# EAGLE design Seeeduino Stalker v3.1 (EAGLE 6.4)
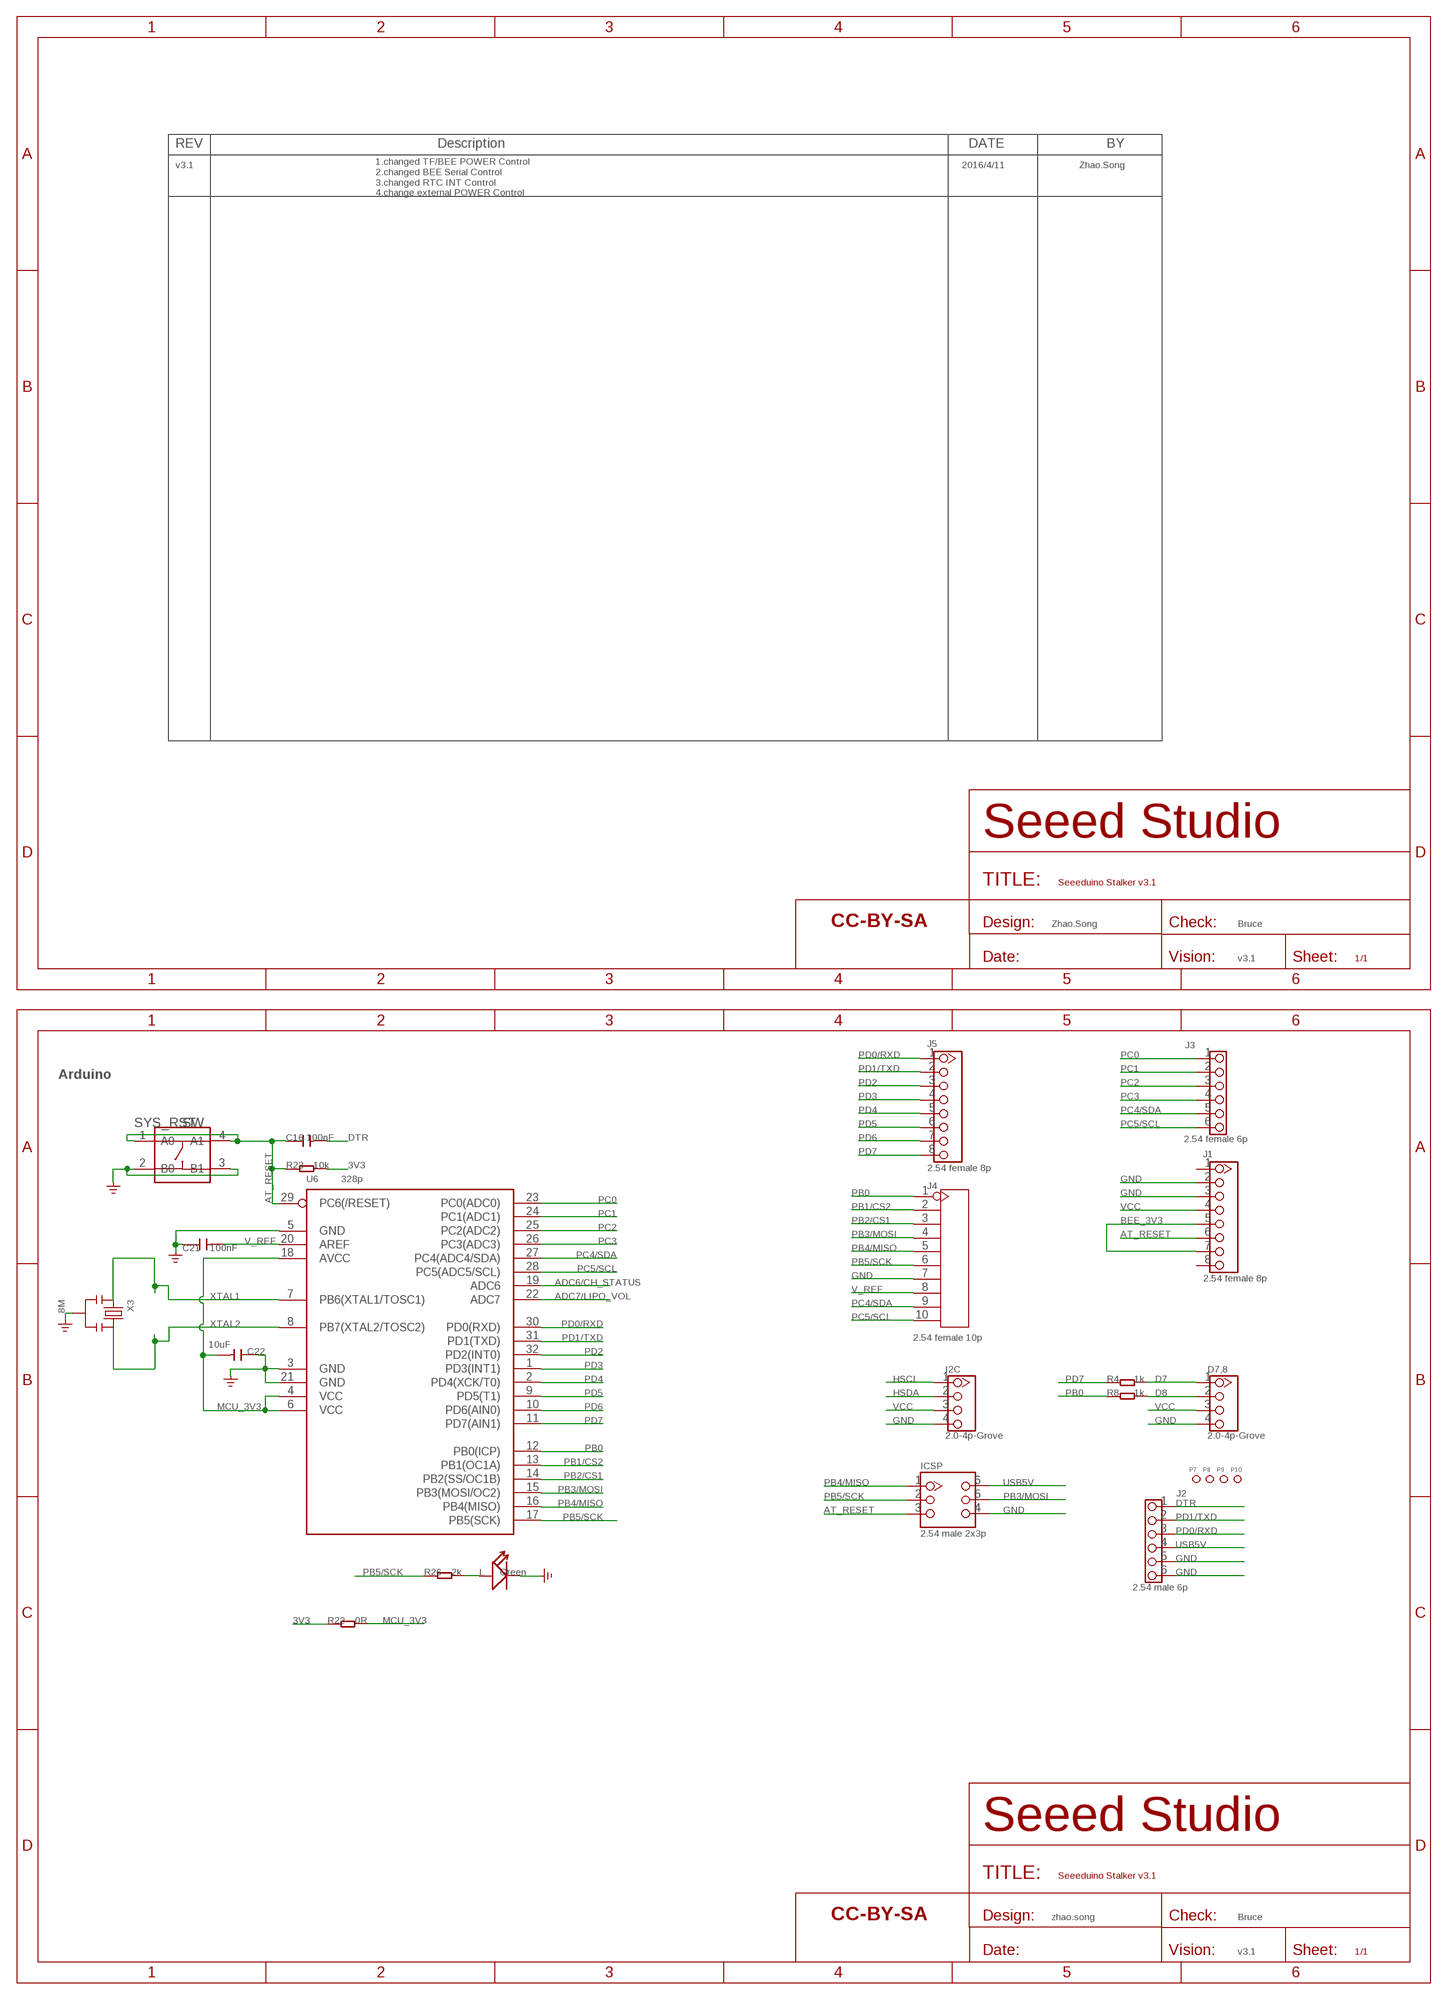
[diagram p0: schematic, sheet 1, part 1 of 2]
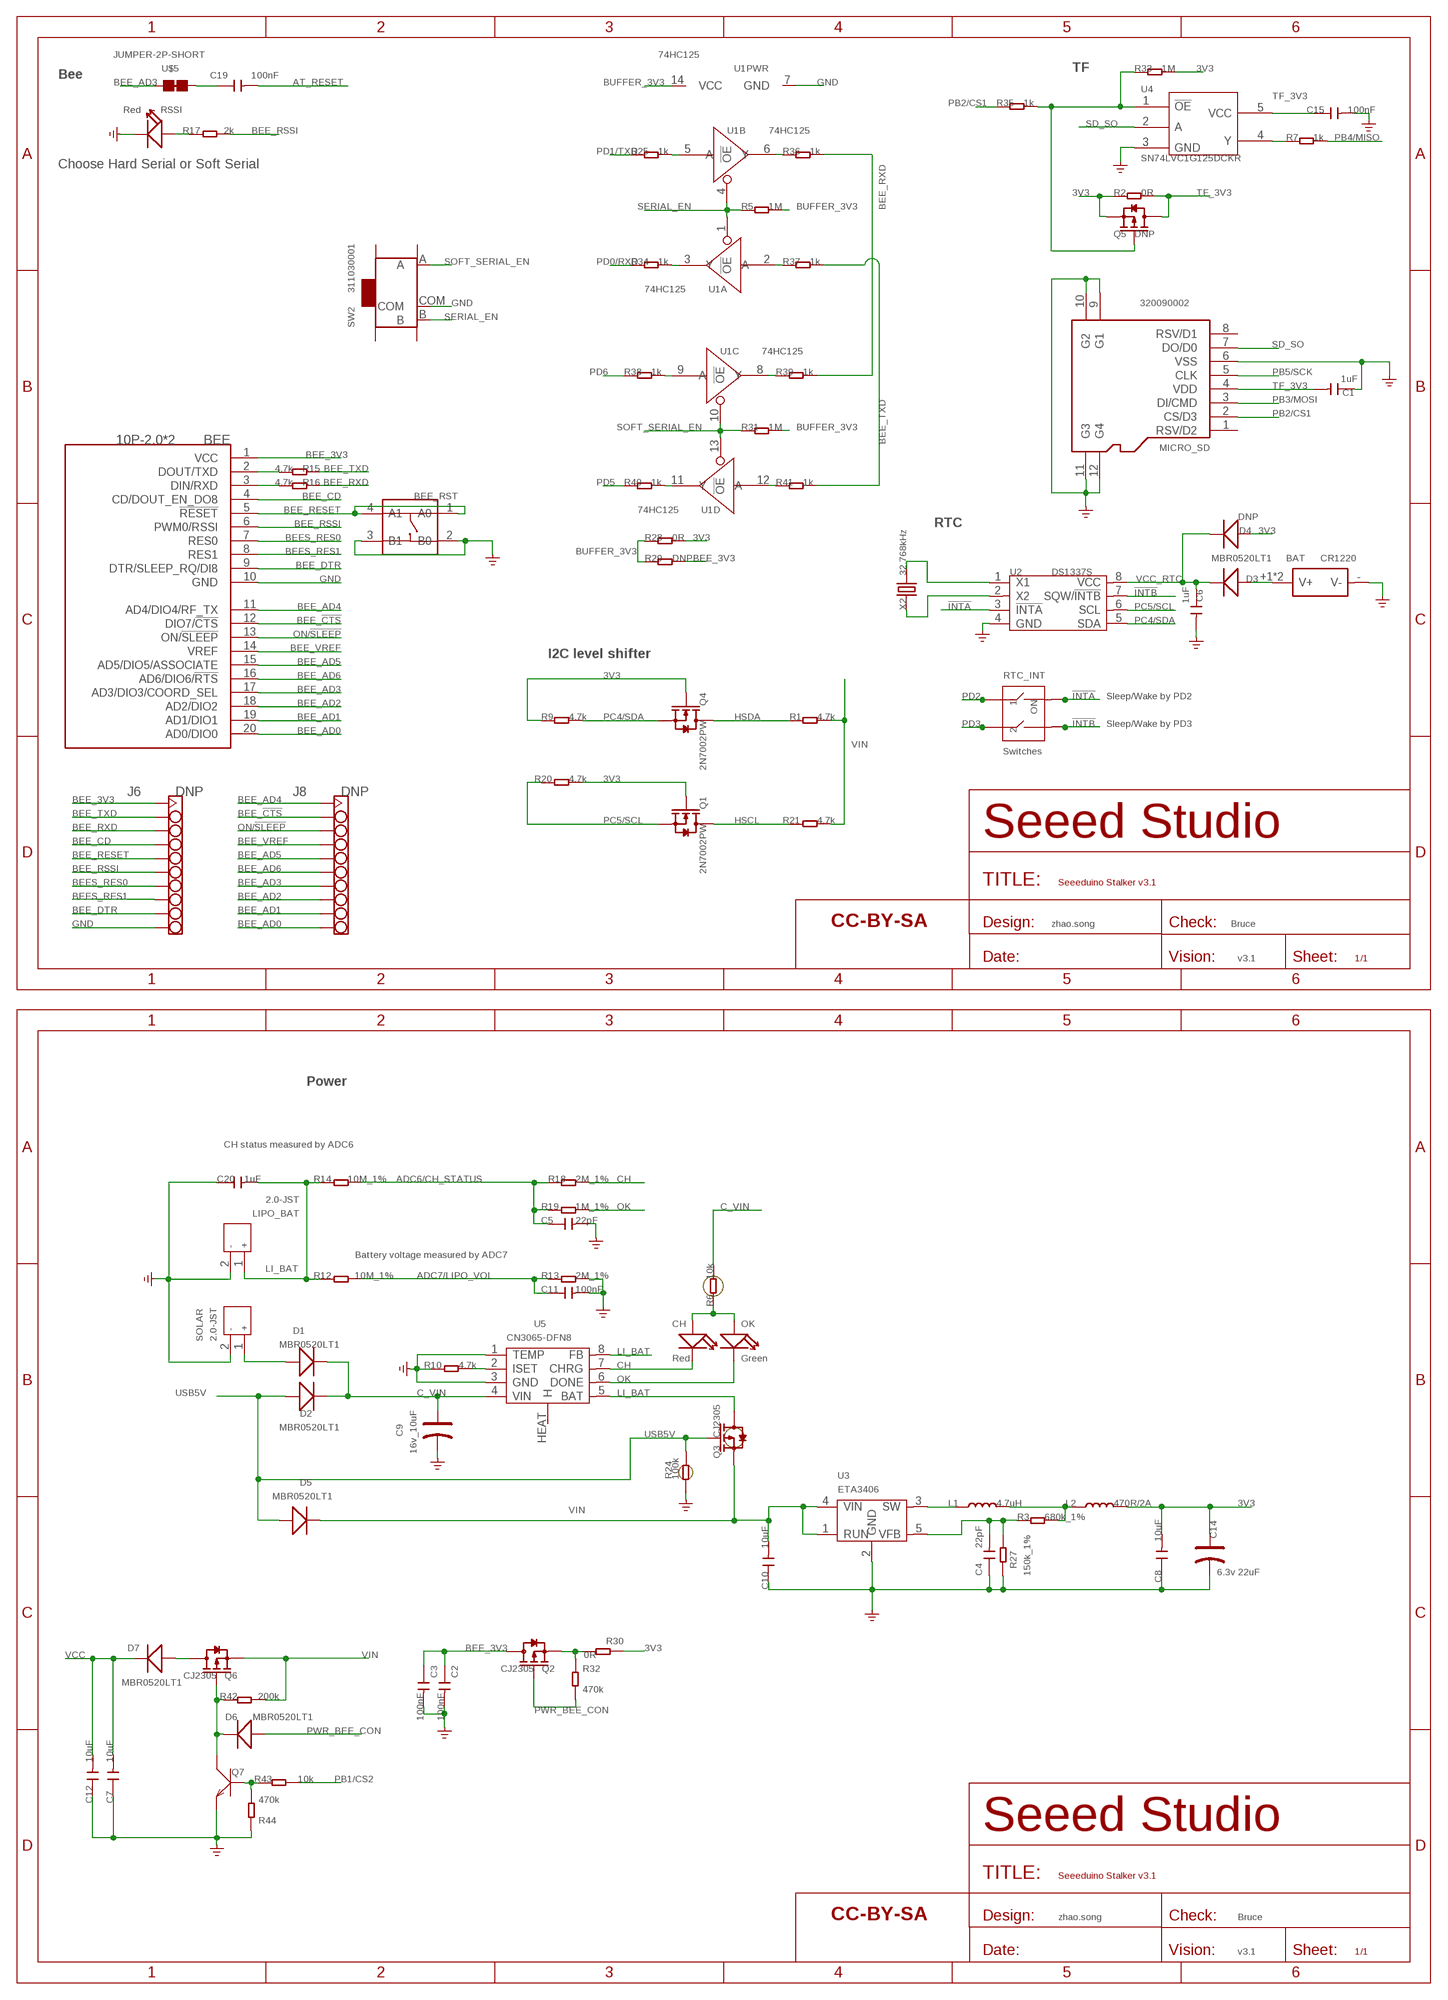
[diagram p1: schematic, sheet 1, part 2 of 2]

## Parts
BAT  CR1220  BAT-HOLDER-1220  [BAT2P-13.5-CR1220]
BEE  10P-2.0*2  BEEO  [BEE]
BEE_RST  SW  BUTTON-4P-6X6-SMD  [4P-SMD-6.2X6.2X4H]
C1  1uF  C-0805  [C0805]
C2  100nF  C-0603  [C0603]
C3  100nF  C-0603  [C0603]
C4  22pF  C-0603  [C0603]
C5  22pF  C-0603  [C0603]
C6  1uF  C-0805  [C0805]
C7  10uF  C-0805  [C0805]
C8  10uF  C-0805  [C0805]
C9  16v_10uF  CAP-AVX-A  [AVX-A]
C10  10uF  C-0805  [C0805]
C11  100nF  C-0603  [C0603]
C12  10uF  C-0805  [C0805]
C14  6.3v 22uF  CAP-AVX-A  [AVX-A]
C15  100nF  C-0603  [C0603]
C16  100nF  C-0603  [C0603]
C19  100nF  C-0603  [C0603]
C20  1uF  C-0805  [C0805]
C21  100nF  C-0603  [C0603]
C22  10uF  C-0805  [C0805]
CH  Red  007-LED0603  [D0603]
D1  MBR0520LT1  D'MBR0520LT1'  [SOD123-2.7X1.6]
D2  MBR0520LT1  D'MBR0520LT1'  [SOD123-2.7X1.6]
D3  MBR0520LT1  D'MBR0520LT1'  [SOD123-2.7X1.6]
D4  DNP  D'MBR0520LT1'  [SOD123-2.7X1.6]
D5  MBR0520LT1  D'MBR0520LT1'  [SOD123-2.7X1.6]
D6  MBR0520LT1  D'MBR0520LT1'  [SOD123-2.7X1.6]
D7  MBR0520LT1  D'MBR0520LT1'  [SOD123-2.7X1.6]
D7,8  2.0-4p-Grove  TWIG-4P-2.0-2.0  [4P-2.0]
I2C  2.0-4p-Grove  TWIG-4P-2.0-2.0  [4P-2.0]
ICSP  2.54 male 2x3p  HEADER-2X3P-2.54  [2X3P-2.54-LEADED]
J1  2.54 female 8p  HEADER-8P-2.54-LEADED  [8P-2.54-LEADED]
J2  2.54 male 6p  HEADER-6P-LEADED-2.54  [6P-2.54-LEADED]
J3  2.54 female 6p  HEADER-6P-LEADED-2.54  [6P-2.54-LEADED]
J4  2.54 female 10p  HEADER-10P-2.54  [10P-2.54]
J5  2.54 female 8p  HEADER-8P-2.54-LEADED  [8P-2.54-LEADED]
J6  DNP  HEADER_1X10DD  [HEADER_1X10]
J8  DNP  HEADER_1X10DD  [HEADER_1X10]
L  Green  007-LED0603  [D0603]
L1  4.7uH  LSPD3D16-4R7M  [L0420]
L2  470R/2A  L'0805'  [L0805]
LIPO_BAT  2.0-JST  JACK-JST-2P-PW'2.0'  [JST-2.0]
MICRO_SD  320090002  MICRO-SD-CARD-HOLDER-8P  [MICRO-SD8+4P-SMD-14.5X13.6X1.8MM]
OK  Green  007-LED0603  [D0603]
P7  DNP  PAD-MARK  [ROUND-MARK-1.0]
P8  DNP  PAD-MARK  [ROUND-MARK-1.0]
P9  DNP  PAD-MARK  [ROUND-MARK-1.0]
P10  DNP  PAD-MARK  [ROUND-MARK-1.0]
Q1  2N7002PW  MOSFET-N'SOT23'  [SOT23]
Q2  CJ2305  MOSFET-P'SI2323CDS/SI2305DS<BR>'  [SOT23]
Q3  CJ2305  MOSFET-P'SI2323CDS/SI2305DS<BR>'  [SOT23]
Q4  2N7002PW  MOSFET-N'SOT23'  [SOT23]
Q5  DNP  MOSFET-P'SI2323CDS/SI2305DS<BR>'  [SOT23]
Q6  CJ2305  MOSFET-P'SI2323CDS/SI2305DS<BR>'  [SOT23]
Q7  TRANSISTOR-NPN-SOT23  [SOT-23]
R1  4.7k  005-R0603  [0603@1]
R2  0R  005-R0603  [0603@1]
R3  680k_1%  005-R0603  [0603@1]
R4  1k  005-R0603  [0603@1]
R5  1M  005-R0603  [0603@1]
R6  10k  005-R0603  [0603@1]
R7  1k  005-R0603  [0603@1]
R8  1k  005-R0603  [0603@1]
R9  4.7k  005-R0603  [0603@1]
R10  4.7k  005-R0603  [0603@1]
R12  10M_1%  005-R0603  [0603@1]
R13  2M_1%  005-R0603  [0603@1]
R14  10M_1%  005-R0603  [0603@1]
R15  4.7k  005-R0603  [0603@1]
R16  4.7k  005-R0603  [0603@1]
R17  2k  005-R0603  [0603@1]
R18  2M_1%  005-R0603  [0603@1]
R19  1M_1%  005-R0603  [0603@1]
R20  4.7k  005-R0603  [0603@1]
R21  4.7k  005-R0603  [0603@1]
R22  0R  005-R0603  [0603@1]
R23  10k  005-R0603  [0603@1]
R24  100k  005-R0603  [0603@1]
R25  1k  005-R0603  [0603@1]
R26  2k  005-R0603  [0603@1]
R27  150k_1%  005-R0603  [0603@1]
R28  0R  005-R0603  [0603@1]
R29  DNP  005-R0603  [0603@1]
R30  0R  005-R0603  [0603@1]
R31  1M  005-R0603  [0603@1]
R32  470k  005-R0603  [0603@1]
R33  1M  005-R0603  [0603@1]
R34  1k  005-R0603  [0603@1]
R35  1k  005-R0603  [0603@1]
R36  1k  005-R0603  [0603@1]
R37  1k  005-R0603  [0603@1]
R38  1k  005-R0603  [0603@1]
R39  1k  005-R0603  [0603@1]
R40  1k  005-R0603  [0603@1]
R41  1k  005-R0603  [0603@1]
R42  200k  005-R0603  [0603@1]
R43  10k  005-R0603  [0603@1]
R44  470k  005-R0603  [0603@1]
RSSI  Red  007-LED0603  [D0603]
RTC_INT  Switches  SWITCHES-2X2P'KM-02'  [SW4-SMD-2.54-5.08X6.8X3.3MM]
SOLAR  2.0-JST  JACK-JST-2P-PW'2.0'  [JST-2.0]
SW2  311030001  SWITCH-3+4P  [SW7-SMD-L6.7X2.7X3.2MM]
SYS_RST  SW  BUTTON-4P-6X6-SMD  [4P-SMD-6.2X6.2X4H]
U1  74HC125  LOGIC-74HCT125PW  [TSSOP14-0.65-5X4.4MM]
U2  DS1337S  [SOP8]
U3  ETA3406  TD6810'TSOT23-5'  [SOT23-5]
U4  SN74LVC1G125DCKR  [SOT353]
U5  CN3065-DFN8  [DFN8]
U6  328p  MCU-ATMEGA8/168/328'AU'  [TQFP32-0.8-7X7MM]
U$2  DNP  SEEEDSTUDIO-OPEN-SCH-FRAME  [SEEEDSTUDIO-PCB-FRAME]
U$5  JUMPER-2P-SHORT  [2P-SMD-SHORT]
U$11  DNP  SEEEDSTUDIO-OPEN-SCH-FRAME  [SEEEDSTUDIO-PCB-FRAME]
U$12  DNP  SEEEDSTUDIO-OPEN-SCH-FRAME  [SEEEDSTUDIO-PCB-FRAME]
U$27  DNP  SEEEDSTUDIO-OPEN-SCH-FRAME  [SEEEDSTUDIO-PCB-FRAME]
X2  32.768kHz  CRYSTAL-3215  [2P-SMD-3.2X1.5]
X3  8M  CRYSTAL-RESONATOR'SMD'  [RESONATOR3-SMD-3.6X1.3X0.8MM]

## Nets
3V3: C8.2 C14.+ D4.1(+) L2.2 Q1.1(G) Q4.1(G) Q5.2(S) R2.1 R9.1 R20.2 R22.1 R23.2 R28.2 R30.1 R33.2
!INTA: RTC_INT.4 U2.3(!INTA)
!INTB: RTC_INT.3 U2.7(SQW/!INTB)
ADC6/CH_STATUS: C5.1 R14.2 R18.1 R19.1 U6.19(ADC6)
ADC7/LIPO_VOL: C11.1 R12.2 R13.1 U6.22(ADC7)
AT_RESET: C16.1 C19.2 ICSP.3 J1.6 R23.1 SYS_RST.1(A0) SYS_RST.4(A1) U6.29(PC6(/RESET))
BEE_3V3: BEE.1(VCC) C2.1 C3.1 J1.5 J1.7 J6.1 Q2.3(D) R29.2
BEE_!CTS: BEE.12(DIO7/!CTS) J8.2
BEE_AD0: BEE.20(AD0/DIO0) J8.10
BEE_AD1: BEE.19(AD1/DIO1) J8.9
BEE_AD2: BEE.18(AD2/DIO2) J8.8
BEE_AD3: BEE.17(AD3/DIO3/COORD_SEL) J8.7 U$5.1
BEE_AD4: BEE.11(AD4/DIO4/RF_TX) J8.1
BEE_AD5: BEE.15(AD5/DIO5/ASSOCIATE) J8.5
BEE_AD6: BEE.16(AD6/DIO6/!RTS) J8.6
BEE_CD: BEE.4(CD/DOUT_EN_DO8) J6.4
BEE_DTR: BEE.9(DTR/SLEEP_RQ/DI8) J6.9
BEE_RESET: BEE.5(!RESET) BEE_RST.1(A0) BEE_RST.4(A1) J6.5
BEE_RSSI: BEE.6(PWM0/RSSI) J6.6 R17.2
BEE_RXD: J6.3 R16.1 R36.2 R39.2
BEE_TXD: J6.2 R15.1 R37.2 R41.2
BEE_VREF: BEE.14(VREF) J8.4
BEES_RES0: BEE.7(RES0) J6.7
BEES_RES1: BEE.8(RES1) J6.8
BUFFER_3V3: R5.2 R28.1 R29.1 R31.2 U1.14(PWR:VCC)
C_VIN: C9.+ D1.2(-) D2.2(-) R6.2 U5.4(VIN)
CH: CH.- R18.2 U5.7(CHRG)
D7: D7,8.1 R4.2
D8: D7,8.2 R8.2
DTR: C16.2 J2.1
GND: BAT.-(V-) BEE.10(GND) BEE_RST.2(B0) BEE_RST.3(B1) C1.1 C2.2 C3.2 C4.1 C5.2 C6.2 C7.1 C8.1 C9.- C10.1 C11.2 C12.1 C14.- C15.2 C20.1 C21.1 C22.1 D7,8.4 I2C.4 ICSP.4 J1.2 J1.3 J2.5 J2.6 J4.7 J6.10 L.- LIPO_BAT.2 MICRO_SD.6(VSS) MICRO_SD.9(G1) MICRO_SD.10(G2) MICRO_SD.11(G3) MICRO_SD.12(G4) Q7.2(E) R10.1 R13.2 R24.1 R27.1 R44.2 RSSI.- SOLAR.2 SW2.COM SYS_RST.2(B0) SYS_RST.3(B1) U1.7(PWR:GND) U2.4(GND) U3.2(GND) U4.3(GND) U5.1(TEMP) U5.3(GND) U6.3(GND) U6.5(GND) U6.21(GND) X3.2 ; supply symbol labelled GND_POWER
HSCL: I2C.1 Q1.3(D) R21.1
HSDA: I2C.2 Q4.3(D) R1.1
LI_BAT: C20.2 LIPO_BAT.1 Q3.3(D) R12.1 R14.1 U5.5(BAT) U5.8(FB)
MCU_3V3: C22.2 R22.2 U6.4(VCC) U6.6(VCC) U6.18(AVCC)
N$1: C4.2 R3.1 R27.2 U3.5(VFB)
N$2: C19.1 U$5.2
N$3: D1.1(+) SOLAR.1
N$4: BAT.+1(V+) BAT.+2(V+) D3.1(+)
N$5: R10.2 U5.2(ISET)
N$6: R17.1 RSSI.+
N$7: U2.1(X1) X2.2
N$8: CH.+ OK.+ R6.1
N$9: U2.2(X2) X2.1
N$13: R34.2 U1.3(A:Y)
N$14: D7.1(+) Q6.3(D)
N$15: R38.2 U1.9(C:A)
N$16: Q7.1(B) R43.2 R44.1
N$17: L1.2 L2.1 R3.2
N$18: L1.1 U3.3(SW)
N$19: R7.1 U4.4(Y)
N$20: R40.2 U1.11(D:Y)
N$22: L.+ R26.2
N$23: R36.1 U1.6(B:Y)
N$24: BEE.2(DOUT/TXD) R15.2
N$25: BEE.3(DIN/RXD) R16.2
N$27: R37.1 U1.2(A:A)
N$28: R39.1 U1.8(C:Y)
N$29: R41.1 U1.12(D:A)
N$30: R25.2 U1.5(B:A)
N$31: Q2.2(S) R30.2 R32.1
N$32: Q5.1(G) R33.1 R35.2 U4.1(!OE!)
N$35: D6.2(-) Q6.1(G) Q7.3(C) R42.2
OK: OK.- R19.2 U5.6(DONE)
ON/!SLEEP: BEE.13(ON/!SLEEP) J8.3
PB0: J4.1 R8.1 U6.12(PB0(ICP))
PB1/CS2: J4.2 R43.1 U6.13(PB1(OC1A))
PB2/CS1: J4.3 MICRO_SD.2(CS/D3) R35.1 U6.14(PB2(SS/OC1B))
PB3/MOSI: ICSP.5 J4.4 MICRO_SD.3(DI/CMD) U6.15(PB3(MOSI/OC2))
PB4/MISO: ICSP.1 J4.5 R7.2 U6.16(PB4(MISO))
PB5/SCK: ICSP.2 J4.6 MICRO_SD.5(CLK) R26.1 U6.17(PB5(SCK))
PC0: J3.1 U6.23(PC0(ADC0))
PC1: J3.2 U6.24(PC1(ADC1))
PC2: J3.3 U6.25(PC2(ADC2))
PC3: J3.4 U6.26(PC3(ADC3))
PC4/SDA: J3.5 J4.9 Q4.2(S) R9.2 U2.5(SDA) U6.27(PC4(ADC4/SDA))
PC5/SCL: J3.6 J4.10 Q1.2(S) R20.1 U2.6(SCL) U6.28(PC5(ADC5/SCL))
PD0/RXD: J2.3 J5.1 R34.1 U6.30(PD0(RXD))
PD1/TXD: J2.2 J5.2 R25.1 U6.31(PD1(TXD))
PD2: J5.3 RTC_INT.1 U6.32(PD2(INT0))
PD3: J5.4 RTC_INT.2 U6.1(PD3(INT1))
PD4: J5.5 U6.2(PD4(XCK/T0))
PD5: J5.6 R40.1 U6.9(PD5(T1))
PD6: J5.7 R38.1 U6.10(PD6(AIN0))
PD7: J5.8 R4.1 U6.11(PD7(AIN1))
PWR_BEE_CON: D6.1(+) Q2.1(G) R32.2
SD_SO: MICRO_SD.7(DO/D0) U4.2(A)
SERIAL_EN: R5.1 SW2.B U1.1(A:!OE) U1.4(B:!OE)
SOFT_SERIAL_EN: R31.1 SW2.A U1.10(C:!OE) U1.13(D:!OE)
TF_3V3: C1.2 C15.1 MICRO_SD.4(VDD) Q5.3(D) R2.2 U4.5(VCC)
USB5V: D2.1(+) D5.1(+) ICSP.6 J2.4 Q3.1(G) R24.2
V_REF: C21.2 J4.8 U6.20(AREF)
VCC: C7.2 C12.2 D7,8.3 D7.2(-) I2C.3 J1.4
VCC_RTC: C6.1 D3.2(-) D4.2(-) U2.8(VCC)
VIN: C10.2 D5.2(-) Q3.2(S) Q6.2(S) R1.2 R21.2 R42.1 U3.1(RUN) U3.4(VIN)
XTAL1: U6.7(PB6(XTAL1/TOSC1)) X3.1
XTAL2: U6.8(PB7(XTAL2/TOSC2)) X3.3
Unconnected: J1.1 J1.8 MICRO_SD.1(RSV/D2) MICRO_SD.8(RSV/D1) SW2.SS1 SW2.SS2 SW2.SS3 SW2.SS4 U5.HEAT(H)

## Notes on the sheet
- TF
- Bee
- v3.1 | 2016/4/11 | Zhao.Song | Choose Hard Serial or Soft Serial
- 1.changed TF/BEE POWER Control
  2.changed BEE Serial Control
  3.changed RTC INT Control
  4.change external POWER Control
- RTC
- I2C level shifter
- Sleep/Wake by PD2
- Sleep/Wake by PD3
- Zhao.Song | Bruce | zhao.song | Bruce
- v3.1 | v3.1
- Arduino
- Power
- CH status measured by ADC6
- Battery voltage measured by ADC7
- zhao.song | Bruce | zhao.song | Bruce
- v3.1 | v3.1

## Library data of the parts
BAT = Connector-new:BAT-HOLDER: BAT2P-13.5-CR1220:320170002;BAT2P-SMD-20.5-CR1632:320170007;METAL-CR2032-D20.0*H6.3MM:320170003;METAL-CR2032-SMD:320170006;PLASTIC-CR1220-L15.06*W13.0*H4.1MM:320170000;PLASTIC-CR2032-L25.2*W15.6*H5.2MM:320170005;BAT2P-11.55-D12.55-CR1220:313010022
BEE = EXT_moudle:BEE
BEE_RST SYS_RST = Discrete:BUTTON-4P
C1-C8 C10-C12 C15 C16 C19-C22 = Discrete:C*: Ceramic Capacitors
C9 C14 = Discrete:CAP*: Electrolytic Capacitors,Tantalum Capacitors and Super Capacitors
CH L OK RSSI = Discrete:007-LED*
D1-D7 = Discrete:D*
D7,8 I2C = Connector:TWIG-4P-2.0
ICSP = Connector:HEADER-2X3P
J1 J5 = Connector:HEADER-8P
J2 J3 = Connector:HEADER-6P
J4 = Connector :HEADER-10P
J6 J8 = CONNECTER:HEADER_1X10
L1 = template:L
L2 = Discrete:L*
LIPO_BAT SOLAR = Connector:JACK-JST-2P-PW
MICRO_SD = Connector-new:MICRO-SD-CARD-HOLDER-8P: 320090002
P7-P10 = Discrete:PAD-MARK; PARTNO: DNP
Q1 Q4 = Discrete:MOSFET-N: IRLL014: http://www.vishay.com/docs/91319/sihll014.pdf
Q2 Q3 Q5 Q6 = Discrete:MOSFET-P
Q7 = Discrete-new:TRANSISTOR-NPN: NPN audion
R1-R10 R12-R44 = Discrete:005-R*
RTC_INT = Discrete-new:SWITCHES-2X2P
SW2 = Discrete-new:SWITCH-3+4P: SW7-SMD-6.7X2.6X1.4MM-90D:311030002;SW7-SMD-L6.7X2.7X3.2MM:311030001
U1 = IC-new:LOGIC-74*125: Quad Buffer/Line Driver;3-state
U2 = AMLib:DS1337: I2C Serial Real-Time clock http://datasheets.maximintegrated.com/en/ds/DS1337-DS1337C.pdf
U3 = IC:TD6810: 1.5MHz 800mA Synchronous Step-Down Regulator Dropout http://www.techcodeok.com/download/TD6810.pdf
U4 = Test:SN74LVC1G125DCKR: Signal bus buffer gate
U5 = IC:CN3065: USB-Compatible Lithiumt-Ion Battery Charger with Thermal Regulation http://www.consonance-elec.com/pdf/%E6%8A%80%E6%9C%AF%E8%AF%B4%E6%98%8E%E4%B9%A6/DSC-CN3065.pdf
U6 = IC-new:MCU-ATMEGA8/168/328
U$2 U$11 U$12 U$27 = moudle-new:SEEEDSTUDIO-OPEN-SCH-FRAME
U$5 = Discrete-new:JUMPER-2P-SHORT
X2 = Discrete:CRYSTAL*: CRYSTAL
X3 = Discrete-new:CRYSTAL-RESONATOR: Resonator Small SMD resonator. This is the itty bitty 10/20MHz resonators with built in caps. CSTCE10M0G55 and CSTCE20M0V53. Footprint has been reviewed closely but hasn't been tested yet.

## Net classes
0 default: width 0.203 mm, drill 0.305 mm, clearance 0.152 mm

## Board
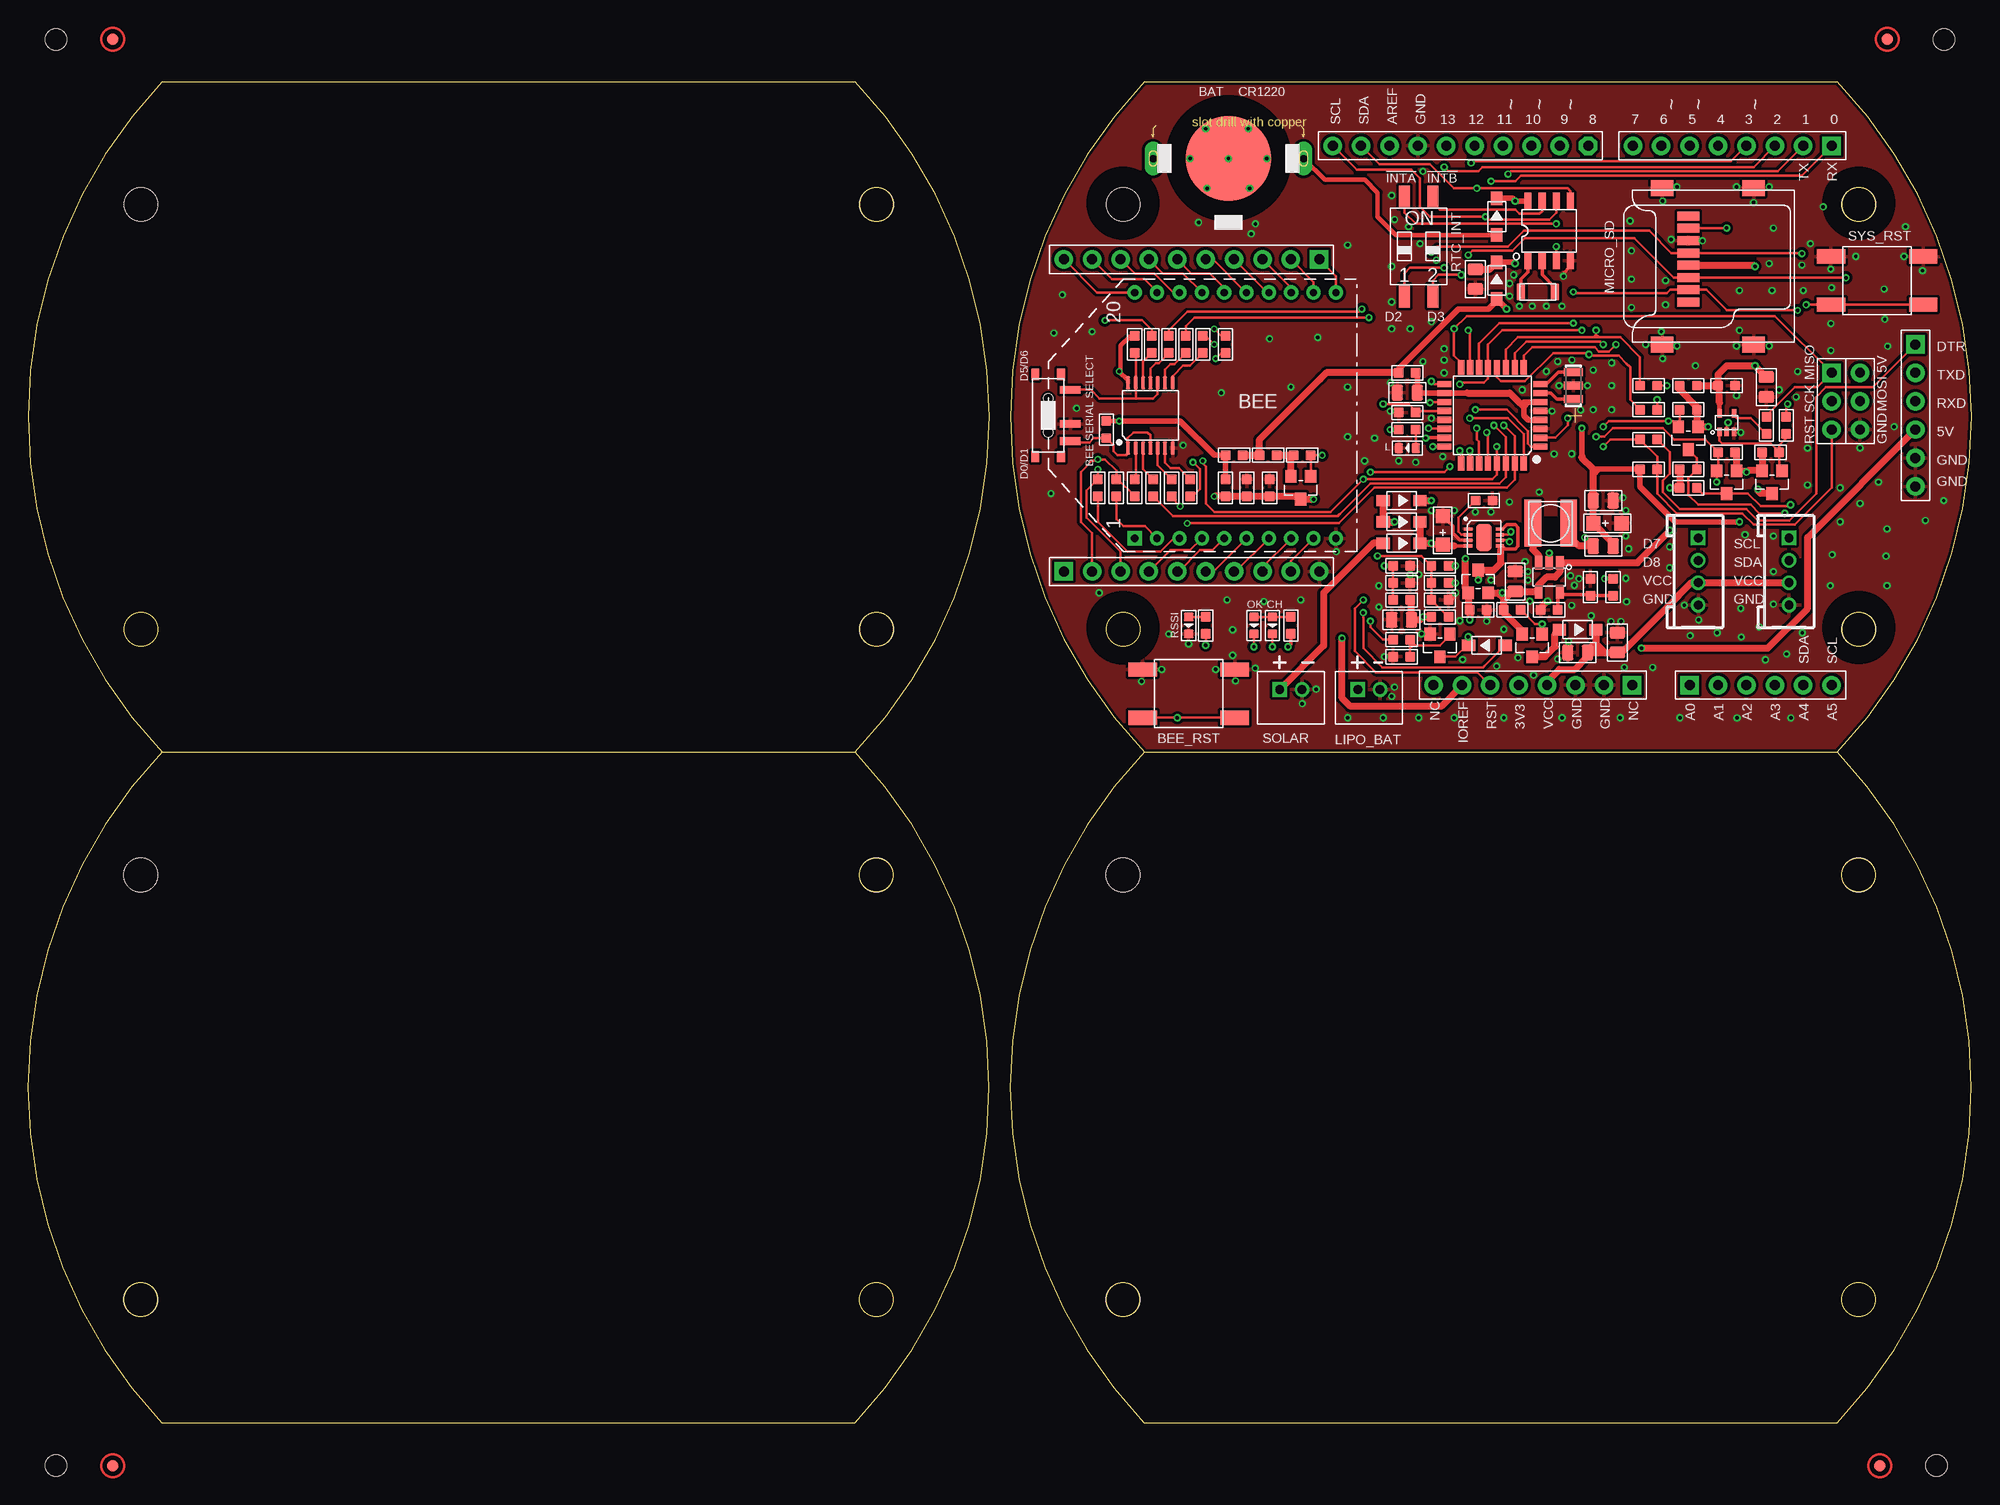
[diagram p2: board, top side]
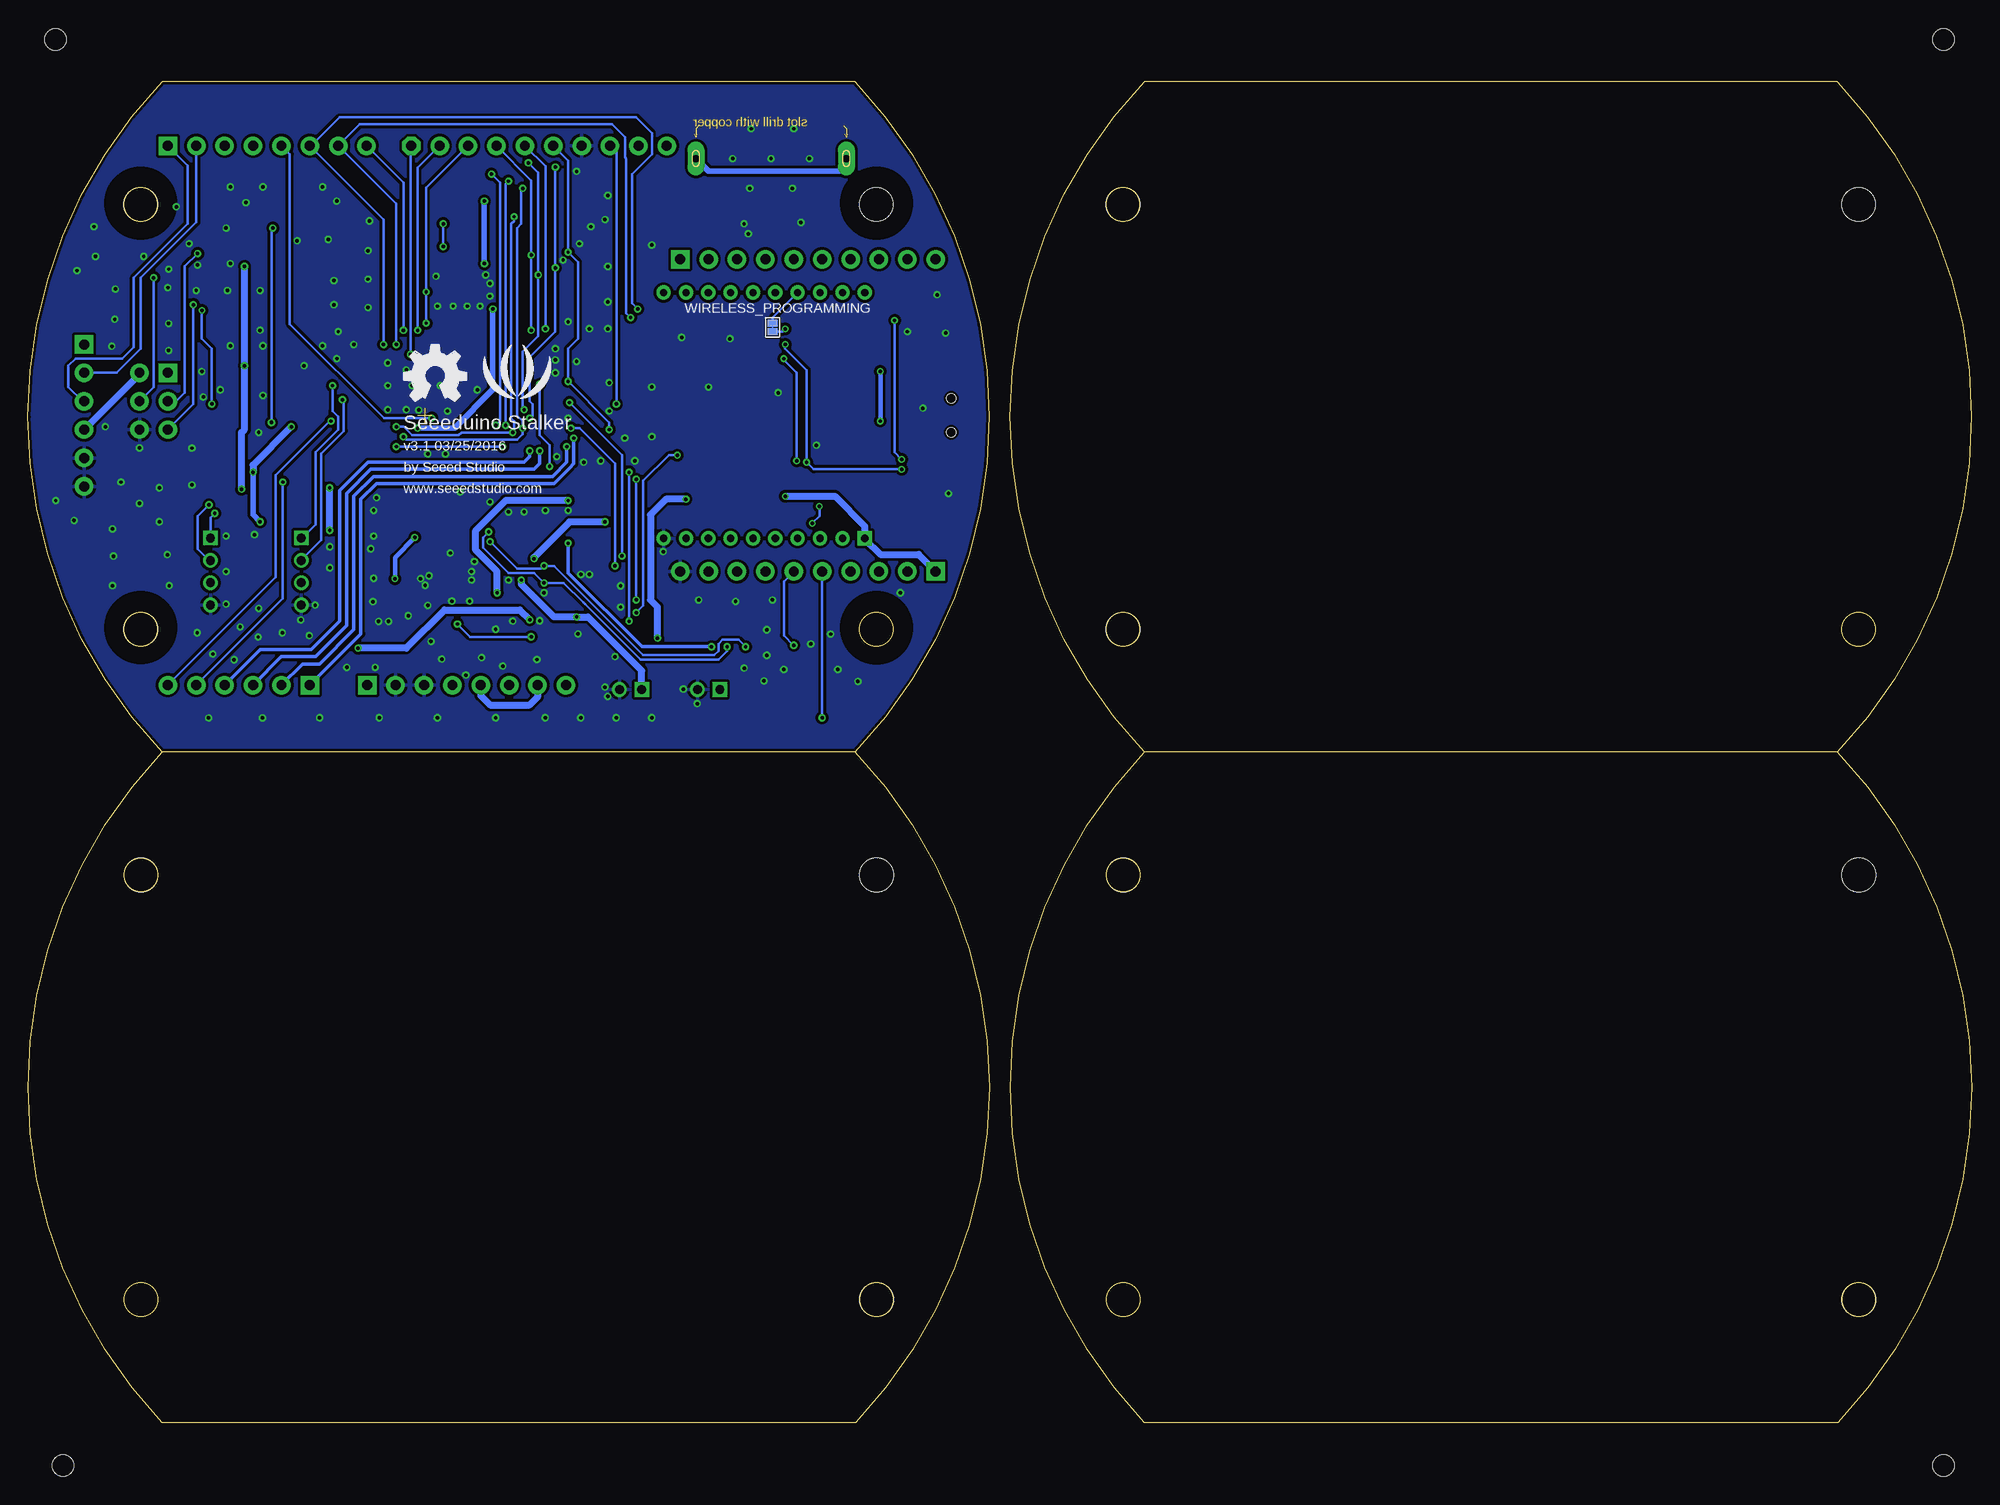
[diagram p3: board, bottom side, seen from below]

Size 173.9 x 120 mm. Coordinates in mm from the lower left corner, seen from the top.
Outline: 99.92,120 161.9,120 arc-87 161.9,60 99.89,60
Outline: 99.92,120 arc87 99.89,60
Outline: 99.9,60 161.88,60 arc-87 161.88,0 99.87,0
Outline: 99.9,60 arc87 99.87,0
Outline: 12.03,120 74.02,120 arc-87 74.02,60 12.01,60
Outline: 12.03,120 arc87 12,60
Outline: 12.01,60 74,60 arc-87 74,0 11.99,0
Outline: 12.01,60 arc87 11.99,0
Outline: circle at 163.81,109 radius 1.5
Outline: circle at 163.81,71 radius 1.5
Outline: circle at 97.99,71 radius 1.5
Outline: circle at 163.8,49 radius 1.5
Outline: circle at 163.8,11 radius 1.5
Outline: circle at 97.97,11 radius 1.5
Outline: circle at 75.93,109 radius 1.5
Outline: circle at 75.93,71 radius 1.5
Outline: circle at 10.11,71 radius 1.5
Outline: circle at 75.91,49 radius 1.5
Outline: circle at 75.91,11 radius 1.5
Outline: circle at 10.09,11 radius 1.5
Copper layers (1*16): Top 0.035mm / dielectric 1.5mm / Bottom 0.035mm
Design rules "default *": minimum track width 1mil, minimum drill 12mil, track to track 6mil, track to pad 6mil, pad to pad 6mil, via to via 6mil, smd to smd 0mil, copper to edge 10mil, drill to drill 10mil, minimum pad ring 10mil, minimum via ring 6mil, stop-mask expansion 2mil, vias tented up to drill 25mil, thermal gap 10mil
Holes 3 mm at 97.99,109 163.82,109 163.82,71 97.99,71 97.97,49 163.8,49 163.8,11 97.97,11 10.11,109 75.93,109 75.93,71 10.11,71 10.09,49 75.91,49 75.91,11 10.09,11
Holes 1.91 mm at 2.51,123.78 171.42,123.78 170.78,-3.85 2.51,-3.85
tRestrict: area 95,106.1 to 101,112.1; area 95,68.1 to 101,74.1; area 160.8,68.1 to 166.8,74.1; area 160.8,106.1 to 166.8,112.1; area 135.4,77 to 137.1,80.9
bRestrict: area 95,106.1 to 101,112.1; area 95,68.1 to 101,74.1; area 160.8,68.1 to 166.8,74.1; area 160.8,106.1 to 166.8,112.1
Milling: 2 lines

### Footprints (pad centres in the part's own frame; a part is rotated, then mirrored left to right if it is on the bottom)
BAT2P-13.5-CR1220 = drill 0.635 pad 1.524 long: +1 6.731,0; +2 -6.731,0 | smd 7.62 x 7.62: - 0,0
BEE = drill 0.635 pad 1.27 square: 1 -11,0 | drill 0.635 pad 1.27: 2 -11,-2; 3 -11,-4; 4 -11,-6; 5 -11,-8; 6 -11,-10; 7 -11,-12; 8 -11,-14; 9 -11,-16; 10 -11,-18; 11 11,-18; 12 11,-16; 13 11,-14; 14 11,-12; 15 11,-10; 16 11,-8; 17 11,-6; 18 11,-4; 19 11,-2; 20 11,0
4P-SMD-6.2X6.2X4H = smd 2.54 x 1.27: 1 -4.129,2.159; 2 -4.129,-2.159; 3 4.129,-2.159; 4 4.129,2.159
C0805 = smd 1.016 x 1.397: 1 -0.889,0; 2 0.889,0
C0603 = smd 0.889 x 0.889: 1 -0.762,0; 2 0.762,0
AVX-A = smd 1.27 x 1.27: + -1.27,0; - 1.27,0
D0603 = smd 0.762 x 0.889: + -0.762,0; - 0.762,0
SOD123-2.7X1.6 = smd 1.2 x 1.02: 1 -1.635,0; 2 1.635,0
4P-2.0 = drill 0.8 pad 1.27 square: 1 -3,0 | drill 0.8 pad 1.27: 2 -1,0; 3 1,0; 4 3,0
2X3P-2.54-LEADED = drill 0.889 pad 1.651 square: 1 -1.27,2.54 | drill 0.889 pad 1.651: 2 -1.27,0; 3 -1.27,-2.54; 4 1.27,-2.54; 5 1.27,0; 6 1.27,2.54
8P-2.54-LEADED = drill 0.889 pad 1.651 square: 1 0,8.89 | drill 0.889 pad 1.651: 2 0,6.35; 3 0,3.81; 4 0,1.27; 5 0,-1.27; 6 0,-3.81; 7 0,-6.35; 8 0,-8.89
6P-2.54-LEADED = drill 0.889 pad 1.651 square: 1 0,6.35 | drill 0.889 pad 1.651: 2 0,3.81; 3 0,1.27; 4 0,-1.27; 5 0,-3.81; 6 0,-6.35
10P-2.54 = drill 0.889 pad 1.651 octagon: 1 0,11.43 | drill 0.889 pad 1.651: 2 0,8.89; 3 0,6.35; 4 0,3.81; 5 0,1.27; 6 0,-1.27; 7 0,-3.81; 8 0,-6.35; 9 0,-8.89; 10 0,-11.43
HEADER_1X10 = drill 0.889 pad 1.651 square: 1 0,11.43 | drill 0.889 pad 1.651: 2 0,8.89; 3 0,6.35; 4 0,3.81; 5 0,1.27; 6 0,-1.27; 7 0,-3.81; 8 0,-6.35; 9 0,-8.89; 10 0,-11.43
L0420 = smd 1.5 x 4.2: 1 -1.6,0; 2 1.6,0
L0805 = smd 1.016 x 1.397: 1 -0.889,0; 2 0.889,0
JST-2.0 = drill 0.8 pad 1.3 square: 1 -1,0.75 | drill 0.8 pad 1.3: 2 1,0.75
MICRO-SD8+4P-SMD-14.5X13.6X1.8MM = smd 0.8 x 2.008: 1 -3.198,0.254; 2 -2.098,0.254; 3 -0.998,0.254; 4 0.102,0.254; 5 1.202,0.254; 6 2.302,0.254; 7 3.402,0.254; 8 4.502,0.254 | smd 1.45 x 2: 9 -7.002,2.6; 10 7.002,2.6; 11 -7.002,-5.598; 12 7.002,-5.598
ROUND-MARK-1.0 = smd 1.016 x 1.016: P$1 0,0
SOT23 = smd 1.016 x 1.143: 1 -0.889,-1.016; 2 0.889,-1.016; 3 0,1.016
SOT-23 = smd 1.016 x 1.143: 1 -0.889,-1.016; 2 0.889,-1.016; 3 0,1.016
0603@1 = smd 0.889 x 0.889: 1 -0.762,0; 2 0.762,0
SW4-SMD-2.54-5.08X6.8X3.3MM = smd 1.016 x 2.032: 1 -1.27,-4.445; 2 1.27,-4.445; 3 1.27,4.445; 4 -1.27,4.445
SW7-SMD-L6.7X2.7X3.2MM = smd 1.8 x 0.7: A 1.978,2.286; B 1.978,-2.286; COM 1.978,-0.762 | smd 0.7 x 1.016: SS1 -1.15,-3.683; SS2 1.15,-3.683; SS3 1.15,3.683; SS4 -1.15,3.683 | hole 0.813: 0,-1.524; 0,1.524
TSSOP14-0.65-5X4.4MM = smd 0.4 x 1.2: 1 -2,-2.925; 2 -1.3,-2.925; 3 -0.65,-2.925; 4 0,-2.925; 5 0.65,-2.925; 6 1.3,-2.925; 7 2,-2.925; 8 2,2.925; 9 1.3,2.925; 10 0.65,2.925; 11 0,2.925; 12 -0.65,2.925; 13 -1.3,2.925; 14 -2,2.925
SOP8 = smd 0.635 x 1.524: 1 -1.905,-2.667; 2 -0.635,-2.667; 3 0.635,-2.667; 4 1.905,-2.667; 5 1.905,2.667; 6 0.635,2.667; 7 -0.635,2.667; 8 -1.905,2.667
SOT23-5 = smd 0.69 x 1.2: 1 -0.95,-1.3; 2 0,-1.3; 3 0.95,-1.3; 4 0.95,1.3; 5 -0.95,1.3
SOT353 = smd 0.4 x 0.75: 1 -0.65,-0.825; 2 0,-0.825; 3 0.65,-0.825; 4 0.65,0.825; 5 -0.65,0.825
DFN8 = smd 0.3 x 0.727: 1 -0.75,-1.413; 2 -0.25,-1.413; 3 0.25,-1.413; 4 0.75,-1.413; 5 0.75,1.413; 6 0.25,1.413; 7 -0.25,1.413; 8 -0.75,1.413 | smd 2.413 x 1.397: HEAT 0,0
TQFP32-0.8-7X7MM = smd 1.27 x 0.559: 1 -4.293,2.8; 2 -4.293,2; 3 -4.293,1.2; 4 -4.293,0.4; 5 -4.293,-0.4; 6 -4.293,-1.2; 7 -4.293,-2; 8 -4.293,-2.8; 17 4.293,-2.8; 18 4.293,-2; 19 4.293,-1.2; 20 4.293,-0.4; 21 4.293,0.4; 22 4.293,1.2; 23 4.293,2; 24 4.293,2.8 | smd 0.559 x 1.27: 9 -2.8,-4.293; 10 -2,-4.293; 11 -1.2,-4.293; 12 -0.4,-4.293; 13 0.4,-4.293; 14 1.2,-4.293; 15 2,-4.293; 16 2.8,-4.293; 25 2.8,4.293; 26 2,4.293; 27 1.2,4.293; 28 0.4,4.293; 29 -0.4,4.293; 30 -1.2,4.293; 31 -2,4.293; 32 -2.8,4.293
2P-SMD-SHORT = smd 0.889 x 0.61: 1 0,0.381; 2 0,-0.381
2P-SMD-3.2X1.5 = smd 0.762 x 1.524: 1 -1.524,0; 2 1.524,0
RESONATOR3-SMD-3.6X1.3X0.8MM = smd 0.7 x 1.7: 1 -1.2,0; 2 0,0; 3 1.2,0

### Placement (x,y rotation side)
BAT  107.41,113.11 180 top
BEE  99.03,90.13 90 top
BEE_RST  103.86,65.24 180 top
C1  155.54,92.67 90 top
C2  111.09,83.65 90 top
C3  109.06,83.65 90 top
C4  136.11,72.73 0 top
C5  126.33,73.62 0 top
C6  129.51,102.32 270 top
C7  138.65,68.92 0 top
C8  140.94,82.51 180 top
C9  126.59,79.84 90 top
C10  133.07,75.27 270 top
C11  122.91,76.67 0 top
C12  142.21,69.81 270 top
C14  141.32,80.48 0 top
C15  151.99,92.79 0 top
C16  145,87.97 0 top
C19  107.16,96.48 270 top
C20  122.91,71.84 0 top
C21  123.41,90.38 0 top
C22  123.41,92.16 0 top
CH  111.35,71.33 270 top
D1  122.91,78.7 0 top
D2  122.91,80.6 0 top
D3  131.41,107.91 90 top
D4  131.41,102.19 90 top
D5  122.91,82.51 0 top
D6  130.53,69.55 180 top
D7  138.65,70.95 0 top
D7,8  149.44,76.16 270 top
I2C  157.57,76.16 270 top
ICSP  162.65,91.4 0 top
J1  134.66,66 270 top
J2  168.88,90.13 0 top
J3  155.03,66 90 top
J4  128.17,114.26 270 top
J5  152.49,114.26 270 top
J6  104.11,76.16 90 top
J8  104.11,104.1 270 top
L  123.41,87.21 180 top
L1  136.24,80.48 0 top
L2  140.94,78.44 0 top
LIPO_BAT  119.98,64.85 0 top
MICRO_SD  148.81,103.46 90 top
OK  109.7,71.33 270 top
P7  7.59,-3.85 0 top  (outside the outline)
P8  7.59,123.78 0 top  (outside the outline)
P9  165.7,-3.85 0 top  (outside the outline)
P10  166.34,123.78 0 top  (outside the outline)
Q1  148.56,88.1 180 top
Q2  113.89,83.65 180 top
Q3  129.76,75.27 0 top
Q4  151.99,84.16 180 top
Q5  156.05,84.16 180 top
Q6  134.59,69.55 180 top
Q7  126.33,69.55 180 top
R1  148.56,83.65 180 top
R2  148.56,92.79 0 top
R3  141.83,74.76 90 top
R4  145,92.79 0 top
R5  96.49,88.86 90 top
R6  113,71.33 270 top
R7  155.54,89.24 90 top
R8  145,90.64 0 top
R9  151.99,86.83 180 top
R10  130.27,82.51 180 top
R12  122.91,73.62 180 top
R13  122.91,75.14 0 top
R14  126.33,72.09 0 top
R15  97.38,83.65 270 top
R16  95.73,83.65 270 top
R17  105.38,71.33 270 top
R18  126.33,75.14 0 top
R19  126.33,76.67 0 top
R20  148.56,90.64 0 top
R21  148.56,85.3 180 top
R22  123.41,93.94 0 top
R23  145,85.3 180 top
R24  129.76,72.73 180 top
R25  102.33,83.65 90 top
R26  123.41,88.86 0 top
R27  139.8,74.76 270 top
R28  107.92,86.57 0 top
R29  107.16,83.65 270 top
R30  110.97,86.57 0 top
R31  99.03,96.48 90 top
R32  114.02,86.57 0 top
R33  155.93,86.83 180 top
R34  100.68,83.65 90 top
R35  157.32,89.24 270 top
R36  103.98,83.65 270 top
R37  99.03,83.65 270 top
R38  103.6,96.48 270 top
R39  105.13,96.48 90 top
R40  102.08,96.48 270 top
R41  100.55,96.48 90 top
R42  132.81,72.73 0 top
R43  122.91,70.06 0 top
R44  122.91,68.54 180 top
RSSI  103.86,71.33 270 top
RTC_INT  124.43,105.24 0 top
SOLAR  113,64.85 0 top
SW2  91.28,90.13 0 top
SYS_RST  165.45,102.19 180 top
U1  100.43,90.13 0 top
U2  136.11,106.64 0 top
U3  136.11,75.65 180 top
U4  151.99,89.49 0 top
U5  130.27,79.21 270 top
U6  131.03,90.13 180 top
U$2  63.22,-46.78 0 top  (outside the outline)
U$5  107.28,98 0 bottom
U$11  63.72,-40.17 0 top  (outside the outline)
U$12  63.09,-32.55 0 top  (outside the outline)
U$23  [OSHW_FILLX200_NOTEXT]  140.3,91.4 0 bottom
U$24  [LOGO_SILK]  130.14,93.3 0 bottom
U$27  62.58,-25.32 0 top  (outside the outline)
X2  135.1,101.18 180 top
X3  138.27,92.79 90 top

### Tracks (layer width: path | path; a pad name or v marks a point on that pad's centre or on a via)
3V3  (via drill 0.3 pad 0.64)
  Top 0.508: 131.41,100.8 D4.1 131.41,100.54 | 131.41,100.54 v132.3,99.65 | v153.13,80.6 147.42,80.6 144.24,83.78 R23.2 140.56,85.3 | Q4.1 153.64,85.17 v153.77,85.05 | 131.41,100.54 131.41,100.41 130.65,99.65 127.99,99.65 122.65,94.32 R22.1 | v139.03,88.98 139.03,86.44 | 140.56,85.3 140.05,85.3 | 140.56,85.3 140.05,84.79
  Top 0.61: L2.2 141.83,78.7 C14.+ C8.2 140.05,84.79 140.05,85.3 139.03,86.32 139.03,86.44 | Q4.1 152.88,86.7 R9.1 | v150.34,89.11 Q1.1 149.32,89.24 R20.2 149.32,90.89 147.8,92.41 R2.1 | R33.2 Q5.2 153.89,85.17 v153.77,85.05 | R28.2 R30.1 110.21,87.97 115.6,93.37 115.79,93.56 116.17,93.94 R22.1
  Bottom 0.508: v153.13,80.6 153.77,81.24 v153.77,85.05 | v139.03,88.98 135.73,88.98 132.3,92.41 v132.3,99.65
  Bottom 0.61: v150.34,89.11 153.77,85.68 v153.77,85.05
!INTA  (via drill 0.3 pad 0.64)
  Top 0.203: v136.75,107.27 124.18,107.27 123.16,108.29 RTC_INT.4 | U2.3 v136.75,105.24
  Bottom 0.203: v136.75,105.24 v136.75,107.27
!INTB
  Top 0.203: U2.7 135.48,108.42 135.22,108.16 133.45,108.16 133.07,108.54 126.33,108.54 125.7,109.18 RTC_INT.3
ADC6/CH_STATUS  (via drill 0.3 pad 0.64)
  Top 0.203: R14.2 C5.1 R18.1 R19.1 124.68,77.55 v120.75,77.55 | U6.19 125.5,91.33 v125.45,91.27
  Bottom 0.203: v125.45,91.27 120.75,86.57 v120.75,77.55
ADC7/LIPO_VOL  (via drill 0.3 pad 0.64)
  Top 0.203: R12.2 R13.1 C11.1 v121.38,76.67 | U6.22 125.38,88.93 v125.32,88.98
  Bottom 0.203: v125.32,88.98 124.56,88.98 121.38,85.81 v121.38,76.67
AT_RESET  (via drill 0.3, 0.3 pad 0.64)
  Top 0.203: SYS_RST.1 SYS_RST.4 v159.1,100.03 | ICSP.3 161.38,83.65 158.08,80.35 154.4,80.35 153.39,81.36 147.53,81.36 145.77,83.13 R23.1 145.77,86.44 C16.1 141.57,87.97 v140.94,87.33 | v131.41,87.33 131.43,87.31 U6.29 131.43,84.81 131.03,84.41 v119.48,84.41 116.56,81.49 106.14,81.49 105.38,82.25 105.38,85.56 105.13,85.81 v105.13,86.06 | C19.2 106.78,95.72 v106.27,95.21 | v119.48,73.62 118.71,72.86 118.71,69.05 120.62,67.14 129.7,67.14 J1.6
  Bottom 0.203: ICSP.3 159.1,91.14 v159.1,100.03 | v131.41,87.33 v140.94,87.33 | v106.27,95.21 106.27,95.08 105.13,93.94 v105.13,86.06 | v119.48,84.41 v119.48,73.62
BEE_3V3  (via drill 0.3, 0.3 pad 0.64)
  Top 0.61: v106.14,82.89 R29.2 C3.1 C2.1 113.63,82.89 Q2.3 v115.03,82.63 | J1.7 128.31,65.94 126.46,64.09 118.33,64.09 117.57,64.85 v117.57,70.19
  Bottom 0.61: v106.14,82.89 101.7,82.89 99.03,80.22 BEE.1 99.03,79.08 97.63,77.68 94.2,77.68 J6.1 | J1.5 133.39,65.05 132.56,64.22 129,64.22 128.31,64.91 J1.7 | v115.03,82.63 116.81,82.63 118.21,81.24 118.21,73.62 117.57,72.98 v117.57,70.19
BEE_!CTS
  Top 0.203: BEE.12 115.03,102.07 J8.2
BEE_AD0
  Top 0.203: BEE.20 95.65,101.13 J8.10
BEE_AD1
  Top 0.203: BEE.19 101.03,101.21 99.92,102.32 97,102.32 J8.9
BEE_AD2
  Top 0.203: BEE.18 102.51,101.13 100.81,102.83 99.03,102.83 J8.8
BEE_AD3
  Top 0.203: BEE.17 105.03,101.15 103.35,102.83 101.57,102.83 J8.7
  Bottom 0.203: U$5.1 107.28,98.87 BEE.17
BEE_AD4
  Top 0.203: BEE.11 117.03,102.61 J8.1
BEE_AD5
  Top 0.203: BEE.15 108.98,101.13 106.01,104.1 J8.5
BEE_AD6
  Top 0.203: BEE.16 107.03,101.56 105.76,102.83 104.11,102.83 J8.6
BEE_CD
  Top 0.203: J6.4 102.2,78.06 103.98,78.06 105,79.08 105,79.1 BEE.4
BEE_DTR
  Top 0.203: J6.9 113,77.1 BEE.9
BEE_RESET  (via drill 0.3 pad 0.64)
  Top 0.203: BEE_RST.4 v102.84,63.08 BEE_RST.1 | J6.5 102.97,76.16 104.87,78.06 105.96,78.06 BEE.5
  Bottom 0.203: J6.5 v102.84,63.08
BEE_RSSI  (via drill 0.3 pad 0.64)
  Top 0.203: J6.6 106.06,76.16 BEE.6 | v105.38,69.55 R17.2
  Bottom 0.203: J6.6 106.27,75.27 106.27,70.44 v105.38,69.55 105.51,69.68
BEE_RXD  (via drill 0.3)
  Top 0.203: J6.3 97.76,77.94 94.71,80.98 94.71,83.4 R16.1 v95.73,85.3 | R36.2 104.24,82.89 104.87,83.52 104.87,85.3 v104.24,85.94 | R39.2 105.38,97.24 v106.14,96.48
  Bottom 0.203: v106.14,96.48 106.14,96.1 104.24,94.19 v104.24,85.94 103.6,85.3 v95.73,85.3
BEE_TXD  (via drill 0.3)
  Top 0.203: J6.2 95.22,79.59 94.2,80.6 94.2,85.05 95.22,86.06 95.6,86.06 v95.73,86.19 96.36,86.19 97.38,85.17 R15.1 97.51,84.41 R37.2 | R41.2 100.55,97.75 99.66,98.64 v96.36,98.64
  Bottom 0.203: v96.36,98.64 96.36,86.83 v95.73,86.19
BEE_VREF
  Top 0.203: BEE.14 110.89,101.13 J8.4
BEES_RES0
  Top 0.203: J6.7 108.06,76.16 BEE.7
BEES_RES1
  Top 0.203: J6.8 110.46,76.56 BEE.8
BUFFER_3V3  (via drill 0.3)
  Top 0.406: R5.2 v97.63,89.62 | U1.14 98.43,93.27 v97.63,94.06 97.76,94.19 97.76,96.35 98.65,97.24 R31.2
  Top 0.508: v97.63,89.62 103.09,89.62 106.14,86.57 R28.1 R29.1
  Bottom 0.406: v97.63,89.62 v97.63,94.06
C_VIN  (via drill 0.3 pad 0.64)
  Top 0.305: U5.4 127.62,78.46 127.6,78.44 | R6.2 113,69.68 v112.75,69.43
  Top 0.61: D2.2 D1.2 v125.57,78.7 125.7,78.57 C9.+ | 126.46,78.7 C9.+ | 127.6,78.44 126.72,78.44 C9.+
  Bottom 0.305: v125.57,78.7 125.57,76.03 118.97,69.43 v112.75,69.43
CH  (via drill 0.3 pad 0.64)
  Top 0.203: CH.- v111.35,69.43 | R18.2 v127.73,75.14 | U5.7 132.43,79.46 v132.68,79.71
  Bottom 0.203: v111.35,69.43 111.35,69.05 112.11,68.28 119.1,68.28 124.05,73.24 124.18,73.36 125.95,75.14 v127.73,75.14 | 127.22,75.14 v127.73,75.14 | v127.73,75.14 128.62,76.03 130.91,76.03 133.19,78.32 133.19,79.21 v132.68,79.71
D7  (via drill 0.3 pad 0.64)
  Top 0.203: v146.65,92.79 R4.2
  Bottom 0.203: D7,8.1 149.37,79.16 148.18,80.35 148.18,86.83 146.15,88.86 146.15,90 146.65,90.51 v146.65,92.79
D8  (via drill 0.3 pad 0.64)
  Top 0.203: R8.2 v145.77,91.52
  Bottom 0.203: D7,8.2 149.44,77.18 147.67,78.95 147.67,86.7 145.64,88.73 145.64,91.4 v145.77,91.52
DTR
  Top 0.203: J2.1 165.07,92.67 160.88,92.67 159.99,91.78 159.99,83.14 157.58,80.73 154.78,80.73 153.77,81.75 147.8,81.75 146.27,83.27 146.27,84.29 146.91,84.92 146.91,86.83 C16.2
GND  (via drill 0.3 pad 0.64)
  Top 0.305: U2.4 138.02,103.46 137.38,102.83 v137.38,102.57 | U5.3 128.11,78.96 127.48,79.59 127.48,80.22 C9.-
  Top 0.508: R44.2 v121.38,68.54 | 127.73,74.25 v127.73,74.25 v127.72,74.26 | U3.2 v136.11,77.81
  Top 0.61: C5.2 127.73,74.25 | R24.1 v130.53,71.71 | C4.1 135.35,72.89 v135.97,73.5
  other vias: 93.82,90.76 103.35,87.46 103.86,69.68 123.67,75.9 127.6,81.62 130.91,81.49 129.51,81.49 138.78,75.52 152.88,91.91 155.8,96.35 147.54,96.35 149.83,105.75 155.8,110.57 147.54,110.57 163.55,104.35 167.86,104.35 142.97,79.33 124.43,75.9 125.57,81.62 122.65,86.06 125.57,89.87 121.89,93.05 121.89,90.51 136.37,90.51 139.54,92.79 141.7,92.79 141.7,90.64 140.05,94.19 101.44,67.39 106.27,67.39 107.41,113.11 110.84,113.11 103.98,113.11 105.51,110.45 109.32,110.45 109.19,115.78 105.38,115.78 126.59,86.44 120.49,88.1 126.02,104.03 138.02,75.78 153.26,88.6 137,92.79 137.26,99.91 135.86,99.91 134.59,99.91 133.45,99.91 132.56,100.8 132.56,101.94 132.94,102.7 141.7,94.83 138.15,95.08 136.88,94.95 135.86,94.06 140.05,90.64 106.78,92.16 115.41,97.11 146.27,95.21 144.75,96.48 146.15,97.62 153.13,97.75 152.88,96.35 149.19,94.57 163.93,87.21 169.51,103.08 154.4,109.18 152.88,110.57 146.27,109.3 143.35,107.53 147.04,105.88 153.13,101.3 156.05,101.3 155.8,103.72 158.72,103.59 158.85,101.3 161.39,101.56 166.09,101.43 167.99,107.02 160.62,108.79 158.21,91.78 158.34,94.06 117.06,77.93 120.87,72.98 113.89,73.61 107.28,73.61 102.08,70.57 107.79,68.66 109.82,67.52 108.05,66.38 107.79,70.95 110.59,73.49 124.17,85.93 119.6,86.06 118.08,88.22 146.53,100.03 146.53,102.19 143.48,99.78 143.48,102.32 143.48,104.86 156.18,106.89 159.48,105.49 166.97,89.11 162.15,83.65 162.15,80.6 163.93,82.25 165.58,84.16 153.64,79.46 156.18,79.33 156.18,76.16 156.18,73.24 154.91,71.2 153.26,72.86 109.82,107.27 118.08,105.37 104.74,107.4 109.44,106.38 113,92.67 118.08,92.67 91.54,83.14 95.85,74.25 95.22,97.62 92.55,100.92 135.22,83.27 99.64,66.33 122.28,65.81 115.26,65.64 114.02,64.34 142.97,75.55 138.36,74.92 148.2,73.14 149.49,71.83 161.31,98.34 161.31,103.22 166.34,79.97 166.34,74.89 161.26,74.89 151.14,70.68 145.38,67.57 142.84,67.57 138.13,73.12 132.56,82.38 169.77,80.73 159.23,83.9 159.23,87.2 171.42,82.5 122.02,100.29 122.02,103.46 124.56,105.49 123.54,107.02 122.27,107.65 124.81,111.97 122.02,109.81 122.02,97.87 123.67,97.87 125.57,98.51 126.72,93.94 126.72,96.1 111.09,96.99 124.81,94.95 126.72,95.08 133.7,92.41 133.95,77.05 128.12,71.75 138.13,86.69 136.55,86.67 138.94,90.61 146.89,76.49 146.89,78.37 91.79,97.49 156.69,92.41 122.03,64.98 120.87,74.88 124.68,70.57 134.38,73.5 128.37,68.28 134.21,76.16 134.21,75.4 130.91,75.4 132.06,70.99 131.42,67.69 133.33,68.45 118.09,63.08 121.26,63.08 124.44,63.08 127.61,63.08 132.06,63.08 137.27,63.08 142.47,63.08 147.81,63.08 148.73,70.42 153.3,70.3 155.46,68.26 152.92,63.06 157.74,63.06 157.36,68.77 158.76,70.68 161.43,77.66 166.25,77.54 161.31,95.93 166.39,96.31 166.14,98.73 136.88,68.32 137.83,69.91 141.64,71.69 142.53,71.69 139.87,72.2 143.04,73.47 142.97,81.62 142.72,82.76 143.23,78.19 134.72,66.89
  pour Top (isolate 0.254, rank 6): 87.6,120.61 174.59,120.61 174.59,90 174.59,60.03 99.03,60.03 87.6,60.03
  pour Bottom (isolate 0.254, rank 6): 87.6,120.61 174.59,120.61 174.59,90 174.59,60.03 99.03,60.03 87.6,60.03
HSCL  (via drill 0.3 pad 0.64)
  Top 0.203: Q1.3 149.32,86.32 R21.1 148.56,84.54 148.56,83.02 149.45,82.13 154.15,82.13 154.91,81.36 v157.2,81.36
  Bottom 0.203: I2C.1 157.57,80.99 v157.2,81.36
HSDA  (via drill 0.3 pad 0.64)
  Top 0.203: R1.1 149.83,83.14 Q4.3 153.89,83.14 155.04,82 157.58,82 v157.7,82.13
  Bottom 0.203: I2C.2 157.69,77.16 158.72,78.19 158.72,81.11 v157.7,82.13
LI_BAT  (via drill 0.3 pad 0.64)
  Top 0.305: 131.8,78.19 131.68,78.3 U5.5 131.91,78.46 132.18,78.19 133.07,78.19 133.32,78.44 133.32,80.09 133.07,80.35 132.3,80.35 131.91,79.96 U5.8
  Top 0.61: R12.1 123.79,73.49 C20.2 124.56,71.84 v124.81,72.09 R14.1 | v129.76,75.4 Q3.3 131.16,76.28 131.8,76.92 131.8,78.19
  Bottom 0.61: v129.76,75.4 129.76,75.01 126.84,72.09 v124.81,72.09 123.79,72.09 123.67,71.97 118.98,67.28 LIPO_BAT.1
MCU_3V3
  Top 0.508: U6.4 134.23,89.73 133.83,90.13 133.83,90.89 | 128.78,92.13 U6.18 124.33,92.13 C22.2 124.3,93.81 R22.2 | 133.83,90.89 133.83,91.33 U6.6 | 133.83,90.89 134.21,91.27 | 133.83,90.89 133.45,91.27
  Top 0.61: 128.78,92.13 132.59,92.13 133.45,91.27
N$1
  Top 0.305: R3.1 R27.2 139.7,74.1 137.32,74.1 U3.5 136.88,74.16 C4.2
N$2  (via drill 0.3)
  Top 0.203: C19.1 106.78,97.24 v106.14,97.87
  Bottom 0.203: U$5.2 106.4,97.62 v106.14,97.87
N$3
  Top 0.61: D1.1 120.37,78.7 115.92,74.25 115.92,69.53 SOLAR.1
N$4
  Top 0.406: D3.1 122.38,106.27 120.75,107.91 120.75,110.07 119.6,111.21 116.05,111.21 BAT.+2
  Bottom 0.508: BAT.+1 100.68,112.61 101.32,111.97 113,111.97 BAT.+2
N$5
  Top 0.203: U5.2 128.24,79.46 127.99,79.71 127.99,80.98 129.19,82.19 129.26,82.25 R10.2
N$6
  Top 0.203: R17.1 RSSI.+
N$7
  Top 0.305: U2.1 134.21,102.95 133.57,102.32 X2.2
N$8
  Top 0.203: OK.+ CH.+ R6.1
N$9
  Top 0.305: X2.1 136.62,101.56 135.48,102.7 U2.2
N$13
  Top 0.203: U1.3 99.78,85.32 R34.2
N$14
  Top 0.61: Q6.3 135.73,68.54 136.62,69.43 136.62,70.55 D7.1
N$15
  Top 0.203: U1.9 101.73,94.22 102.2,94.7 102.59,94.7 R38.2
N$16
  Top 0.203: R44.1 123.67,69.3 | 123.67,69.3 123.67,69.55 | 123.67,69.55 R43.2 | Q7.1 127.22,70.44 126.33,69.55 124.18,69.55 | 124.18,69.55 124.05,69.55 123.92,69.55 | 123.92,69.55 123.67,69.55 | 124.18,69.55 123.92,69.81 | 123.92,69.55 123.67,69.3
N$17  (via drill 0.3)
  Top 0.406: R3.2 v141.07,75.52
  Top 0.508: L2.1 v139.29,79.21
  Top 0.61: L2.1 138.78,78.44 137.84,79.38 L1.2
  Bottom 0.406: v141.07,75.52 141.07,77.43 v139.29,79.21
N$18
  Top 0.61: L1.1 134.64,78.14 135.16,77.62 U3.3
N$19
  Top 0.203: U4.4 152.64,90.11 152.88,89.87 154.15,89.87 R7.1
N$20
  Top 0.203: U1.11 100.43,94.32 100.93,94.83 101.19,94.83 R40.2
N$22
  Top 0.203: R26.2 L.+
N$23
  Top 0.203: U1.6 101.73,85.91 102.2,85.43 102.97,85.43 R36.1
N$24
  Top 0.203: R15.2 97.38,80.86 98.01,80.22 99.94,80.22 BEE.2
N$25
  Top 0.203: BEE.3 102.51,79.13 101.32,77.94 98.39,77.94 95.73,80.6 R16.2
N$27
  Top 0.203: U1.2 99.13,84.51 R37.1
N$28
  Top 0.203: U1.8 102.43,93.65 103.35,94.57 103.98,94.57 R39.1
N$29
  Top 0.203: U1.12 99.78,94.94 R41.1
N$30
  Top 0.203: U1.5 101.08,85.67 R25.2
N$31
  Top 0.61: R30.2 112.62,86.57 | 112.62,86.57 113.13,86.57 | 113.13,86.57 R32.1 | Q2.2 113,85.56 113,86.19 | 113,86.19 113,86.44 113.13,86.57 | 113,86.19 112.62,86.57
N$32
  Top 0.203: U4.1 151.34,87.86 151.61,87.59 155.93,87.59 R33.1 | R33.1 156.69,85.43 Q5.1 | R35.2 157.32,88.1 156.69,87.46 R33.1
N$35  (via drill 0.3 pad 0.64)
  Top 0.203: R42.2 133.57,72.6 133.7,72.6 134.84,71.46 v135.48,71.46 Q6.1 | Q7.3 127.73,68.54 128.75,69.55 D6.2 128.89,70.3 v128.87,70.32
  Bottom 0.203: v135.48,71.46 134.34,70.32 v128.87,70.32
OK  (via drill 0.3 pad 0.64)
  Top 0.203: OK.- v109.7,69.43 | R19.2 v127.73,76.67 | U5.6 132.43,78.96 v132.56,78.82
  Bottom 0.203: v109.7,69.43 110.33,70.06 111.73,70.06 112.11,69.68 112.11,69.05 112.49,68.66 118.84,68.66 126.84,76.67 v127.73,76.67 127.99,76.41 130.14,76.41 v132.56,78.82
ON/!SLEEP
  Top 0.203: BEE.13 113.03,101.53 J8.3
PB0  (via drill 0.3 pad 0.64)
  Top 0.203: U6.12 131.43,93.54 131.8,93.18 133.95,93.18 136.49,95.72 139.54,95.72 v139.67,95.59 139.8,95.46 142.34,95.46 143.04,94.76 143.35,94.45 143.35,91.52 R8.1
  Bottom 0.203: J4.1 139.67,114.19 v139.67,95.59
PB1/CS2  (via drill 0.3, 0.3 pad 0.64)
  Top 0.203: v139.03,97.75 131.92,97.75 130.63,96.46 U6.13 130.63,93.41 130.27,93.05 128.24,93.05 v128.11,92.92 | v127.22,85.56 126.72,85.05 v120.11,85.05 | R43.1 121.25,70.06 120.11,71.2 v120.11,71.71
  Bottom 0.203: v139.03,97.75 139.03,112.28 J4.2 | v127.22,85.56 127.22,87.46 128.11,88.35 v128.11,92.92 | v120.11,85.05 v120.11,71.71
PB2/CS1  (via drill 0.3)
  Top 0.203: U6.14 129.83,96.55 131.67,98.38 v138.27,98.38 | v138.27,101.18 138.4,101.05 146.65,101.05 146.97,101.36 MICRO_SD.2 150.15,101.36 151.99,99.53 v158.34,99.53 | R35.1 157.32,91.02 v157.45,91.14
  Bottom 0.203: v138.27,98.38 v138.27,101.18 138.27,110.51 J4.3 | v158.34,99.53 158.34,96.99 157.45,96.1 v157.45,91.14
PB3/MOSI  (via drill 0.3 pad 0.64)
  Top 0.203: v162.66,102.45 162.64,102.46 MICRO_SD.3 147.27,102.46 143.73,106 133.95,106 132.81,104.86 129.26,104.86 v128.87,104.48 | U6.15 129.03,97.59 v128.87,97.75
  Bottom 0.203: ICSP.5 162.66,92.67 v162.66,102.45 | v128.87,97.75 v128.87,104.48 128.87,104.73 128.87,111.15 J4.4
PB4/MISO  (via drill 0.3 pad 0.64)
  Top 0.203: U6.16 128.23,94.83 127.6,95.46 v127.6,97.87 128.75,99.02 156.31,99.02 ICSP.1 160.11,92.67 158.08,92.67 155.54,90.13 R7.2
  Bottom 0.203: J4.5 127.6,112.42 v127.6,97.87
PB5/SCK  (via drill 0.3 pad 0.64)
  Top 0.203: U6.17 125.82,92.93 v125.57,93.18 | v158.72,104.61 158.66,104.66 MICRO_SD.5 147.04,104.66 145.06,106.64 133.83,106.64 132.43,105.24 126.08,105.24 v125.57,104.73 | v121.89,88.86 R26.1
  Bottom 0.203: J4.6 125.57,112.93 v125.57,104.73 124.68,103.84 124.68,96.99 125.57,96.1 v125.57,93.18 121.89,89.49 v121.89,88.86 | ICSP.2 160.62,91.4 159.86,92.16 159.86,103.46 v158.72,104.61
PC0  (via drill 0.3 pad 0.64)
  Top 0.305: U6.23 125.1,88.13 v125.06,88.1
  Bottom 0.305: J3.1 144.11,70.57 144.11,82.63 142.72,84.03 126.84,84.03 125.32,85.56 125.19,85.68 125.06,85.81 v125.06,88.1
PC1  (via drill 0.3 pad 0.64)
  Top 0.305: U6.24 v125.71,87.33 v125.7,87.33
  Bottom 0.305: J3.2 149.32,67.9 147.8,67.9 144.75,70.95 144.75,82.89 142.97,84.67 126.97,84.67 125.7,85.94 v125.7,87.33
PC2  (via drill 0.3 pad 0.64)
  Top 0.305: U6.25 128.23,86.83 v128.11,86.95
  Bottom 0.305: J3.3 151.23,68.54 148.18,68.54 145.38,71.33 145.38,83.14 143.23,85.3 128.62,85.3 128.11,85.81 v128.11,86.95
PC3  (via drill 0.3 pad 0.64)
  Top 0.305: U6.26 129.03,86.92 v129,86.95
  Bottom 0.305: J3.4 153.13,69.17 148.56,69.17 146.02,71.71 146.02,83.4 143.48,85.94 129.51,85.94 129,86.44 v129,86.95
PC4/SDA  (via drill 0.3 pad 0.64)
  Top 0.203: v151.1,84.16 Q4.2 151.23,85.3 R9.2 150.08,87.97 147.29,87.97 146.27,88.98 141.83,88.98 141.07,88.22 v140.3,88.22 | U6.27 129.83,87.77 129.64,87.97 v129.64,88.98 | U2.5 138.02,110.19 137.76,110.45 v129.64,110.45 127.6,110.45 125.45,112.61 120.93,112.61 J4.9
  Bottom 0.203: v151.1,84.16 151.1,73.74 J3.5 | v129.64,110.45 129.76,110.32 129.76,107.27 130.14,106.89 130.14,90.13 129.64,89.62 v129.64,88.98 129.64,88.48 130.14,87.97 140.05,87.97 v140.3,88.22
PC5/SCL  (via drill 0.3 pad 0.64)
  Top 0.203: R20.1 147.8,89.24 Q1.2 147.16,89.62 v146.78,89.62 141.45,89.62 v140.94,89.11 | U6.28 130.63,88.5 v130.53,88.6 | U2.6 136.75,108.29 136.11,107.65 130.65,107.65 v130.4,107.91 125.45,107.91 124.56,108.8 124.56,111.34 123.79,112.1 118.9,112.1 J4.10
  Bottom 0.203: J3.6 151.73,75.65 151.73,84.79 146.91,89.62 v146.78,89.62 | v130.4,107.91 130.4,107.53 130.65,107.27 130.65,89.87 130.4,89.62 130.4,88.73 v130.53,88.6 135.1,88.6 135.35,88.35 139.54,88.35 140.3,89.11 v140.94,89.11
PD0/RXD  (via drill 0.3 pad 0.64)
  Top 0.203: v130.91,111.08 133.07,111.08 133.57,111.59 158.72,111.59 J5.1 | v131.16,89.24 132.23,88.17 U6.30 132.23,84.6 131.67,84.03 120.11,84.03 117.38,81.3 117.32,81.24 117.19,81.11 102.46,81.11 R34.1
  Bottom 0.203: J2.3 169.01,91.4 170.28,92.67 170.28,94.57 169.64,95.21 165.45,95.21 164.43,96.22 164.43,102.45 159.61,107.27 159.61,112.48 J5.1 | v131.16,89.24 131.16,110.83 v130.91,111.08
PD1/TXD  (via drill 0.3, 0.3 pad 0.64)
  Top 0.203: v132.43,111.72 132.68,111.97 156.56,111.97 J5.2 | v132.05,89.24 133.03,88.25 U6.31 133.03,84.38 132.3,83.65 120.49,83.65 117.32,80.48 v103.73,80.48 | R25.1 102.33,82.76 v103.09,82
  Bottom 0.203: J5.2 158.84,107.4 163.8,102.45 163.8,96.1 165.96,93.94 J2.2 | v132.43,111.72 131.67,110.96 131.67,89.62 v132.05,89.24 | v103.09,82 103.09,81.11 v103.73,80.48
PD2  (via drill 0.3 pad 0.64)
  Top 0.203: U6.32 133.83,88.47 132.43,89.87 v129,89.87 | v126.72,103.34 123.67,103.34 123.16,102.83 RTC_INT.1 | J5.3 154.4,112.35 130.14,112.35 129.76,111.97 127.1,111.97 v126.72,112.35
  Bottom 0.203: v126.72,112.35 v126.72,103.34 126.72,97.62 129,95.33 129,91.4 128.75,91.14 128.75,90.13 v129,89.87
PD3  (via drill 0.3 pad 0.64)
  Top 0.203: U6.1 134.47,87.33 134.21,87.59 134.21,88.73 132.3,90.64 v129.51,90.64 | v128.24,102.7 126.21,102.7 125.7,102.19 RTC_INT.2 | J5.4 152.37,112.86 129.26,112.86 v129.13,112.73
  Bottom 0.203: v129.13,112.73 128.24,111.84 v128.24,102.7 128.24,97.24 129.64,95.84 129.64,90.76 v129.51,90.64
PD4  (via drill 0.3 pad 0.64)
  Top 0.203: U6.2 136.65,88.13 137.76,89.24 v137.76,89.87
  Bottom 0.203: v137.76,89.87 142.04,89.87 150.46,98.29 150.46,113.5 J5.5
PD5  (via drill 0.3 pad 0.64)
  Top 0.203: U6.9 133.83,95.47 134.59,96.22 140.18,96.22 140.56,95.84 141.45,95.84 v142.08,96.48 | R40.1 102.08,97.75 103.73,99.4 119.1,99.4 v119.35,99.65
  Bottom 0.203: v142.08,96.48 142.08,107.66 J5.6 148.56,114.26 146.02,116.8 119.48,116.8 118.08,115.4 118.08,113.5 119.86,111.72 119.86,100.16 v119.35,99.65
PD6  (via drill 0.3 pad 0.64)
  Top 0.203: U6.10 133.03,95.68 134.08,96.73 140.69,96.73 v140.94,96.48 | R38.1 103.6,98.13 104.36,98.89 v119.98,98.89
  Bottom 0.203: v140.94,96.48 140.94,109.05 J5.7 144.24,116.16 121.64,116.16 120.49,115.02 120.49,113.24 120.37,113.11 120.37,99.27 v119.98,98.89
PD7  (via drill 0.3 pad 0.64)
  Top 0.203: U6.11 132.23,96.03 133.32,97.11 140.05,97.11 | 140.05,97.11 140.3,97.11 | 140.3,97.11 140.56,97.11 | 140.56,97.11 142.46,97.11 144.24,95.33 R4.1 | v140.3,97.75 140.3,97.37 | 140.3,97.37 140.3,97.11 | 140.05,97.11 140.3,97.37 | 140.3,97.37 140.56,97.11
  Bottom 0.203: v140.3,97.75 140.3,110.96 J5.8
PWR_BEE_CON  (via drill 0.3, 0.3 pad 0.64)
  Top 0.203: Q2.1 R32.2 v115.79,86.57 | v119.48,72.47 119.48,69.3 121.19,67.58 130.19,67.58 130.26,67.65 130.3,67.69 D6.1
  Bottom 0.203: v115.79,86.57 116.56,86.57 118.84,84.29 118.84,73.11 v119.48,72.47
SD_SO  (via drill 0.3 pad 0.64)
  Top 0.203: v151.99,106.89 148.59,106.89 MICRO_SD.7 | U4.2 151.99,89.37 v152.12,89.49
  Bottom 0.203: v152.12,89.49 152.12,106.76 v151.99,106.89
SERIAL_EN
  Top 0.203: U1.4 100.43,88.35 100.17,88.6 98.9,88.6 98.39,88.1 98.39,87.23 U1.1 98.43,86.73 98.27,86.57 97.51,86.57 97.12,86.95 97.12,87.46 R5.1 95.35,88.1 94.97,87.71 93.39,87.71 SW2.B
SOFT_SERIAL_EN
  Top 0.203: R31.1 99.13,95.62 U1.13 99.16,93.02 99.16,91.78 99.28,91.65 | U1.10 101.08,92.05 100.68,91.65 99.92,91.65 99.28,91.65 | SW2.A 95.09,92.41 95.85,91.65 99.28,91.65
TF_3V3  (via drill 0.3, 0.3 pad 0.64)
  Top 0.406: U4.5 151.34,91.26 151.35,91.27
  Top 0.61: MICRO_SD.4 154.43,103.56 v154.53,103.46 | Q5.3 155.04,83.14 154.78,83.4 v154.78,83.52 | 151.35,91.27 151.35,92.67 C15.1 | R2.2 C15.1 | C1.2 v154.53,94.57 151.99,94.57 151.23,93.81 C15.1
  Bottom 0.61: v154.53,103.46 v154.53,94.57 154.53,88.86 154.78,88.6 v154.78,83.52
USB5V  (via drill 0.3 pad 0.64)
  Top 0.61: D5.1 D2.1 v122.27,80.6 | v128.62,77.3 128.62,74.63 128.87,74.38 Q3.1 128.87,72.86 R24.2 v129,71.84 | J2.4 159.23,79.21 159.23,72.86 155.67,69.3 v144.37,69.3
  Bottom 0.61: v128.62,77.3 128.62,77.43 125.45,80.6 v122.27,80.6 | ICSP.6 163.92,93.81 J2.4 | v144.37,69.3 140.05,69.3 136.62,72.73 129.89,72.73 v129,71.84
V_REF  (via drill 0.3 pad 0.64)
  Top 0.203: U6.20 124.32,90.53 C21.2 124.18,90.51 123.54,91.14 v121.25,91.14
  Bottom 0.203: J4.8 121.25,113.69 v121.25,91.14
VCC
  Top 0.61: I2C.3 D7,8.3 148.83,75.16 147.8,74.13 147.73,74.06 142.59,68.92 C12.2 139.8,68.92 | J1.4 135.93,66.32 137,67.39 138.4,67.39 139.54,68.54 C7.2 139.8,68.92 | D7.2 140.29,69.79 | 140.29,69.7 140.29,69.41 139.8,68.92 | 140.29,69.79 139.67,69.17 | 140.29,69.79 140.29,69.7 | 140.29,69.7 140.94,69.05
VCC_RTC  (via drill 0.3 pad 0.64)
  Top 0.508: D3.2 132.83,109.54 v133.07,109.3 U2.8 | D4.2 132.95,103.83 v133.07,103.72
  Top 0.61: C6.1 130.8,103.21 D4.2
  Bottom 0.508: v133.07,109.3 v133.07,103.72
VIN  (via drill 0.3 pad 0.64)
  Top 0.61: R21.2 R1.2 v146.91,83.65 | Q6.2 133.7,70.82 132.05,72.47 R42.1 132.05,73.49 132.05,73.62 | v146.91,79.84 144.02,76.95 U3.1 137.06,76.09 136.62,75.65 135.86,75.65 135.16,74.95 U3.4 135.13,74.38 C10.2 132.94,74.25 132.68,74.25 | 132.68,74.25 v131.92,74.25 | D5.2 v125.57,82.51 | 132.05,73.74 132.05,74.13 v131.92,74.25 | Q3.2 131.54,74.25 | 131.54,74.25 v131.92,74.25 | 132.05,73.62 132.05,73.74 | 132.05,73.74 131.54,74.25 | 132.05,73.62 132.68,74.25
  Bottom 0.61: v146.91,79.84 v146.91,83.65 | v131.92,74.25 131.92,76.16 133.83,78.06 133.83,79.84 133.7,79.97 133.64,80.03 131.16,82.51 v125.57,82.51
XTAL1
  Top 0.305: U6.7 136.27,92.13 136.81,91.59 X3.1
XTAL2
  Top 0.305: U6.8 135.87,92.93 136.93,93.99 X3.3

### Text on the board
tPlace: CR1220 | ~ | ~ | ~ | ~ | ~ | ~ | SCL | SDA | AREF | GND | 13 | 12 | 11 | 10 | 9 | 8 | 7 | 6 | 5 | 4 | 3 | 2 | 1 | 0 | !INTA | !INTB | TX | RX | D2 | D3 | DTR | 5V | D5/D6 | MISO | TXD | RXD | SCK | MOSI | 5V | RST | GND | GND | BEE SERIAL SELECT | D0/D1 | GND | D7 | SCL | D8 | SDA | VCC | VCC | GND | GND | SDA | SCL | NC | NC | A0 | A1 | A2 | A3 | A4 | A5 | RST | 3V3 | VCC | GND | GND | IOREF
bPlace: WIRELESS_PROGRAMMING | Seeeduino Stalker | v3.1 03/25/2016 | by Seeed Studio | www.seeedstudio.com